# Altium project NFC_EEG.PrjPcb
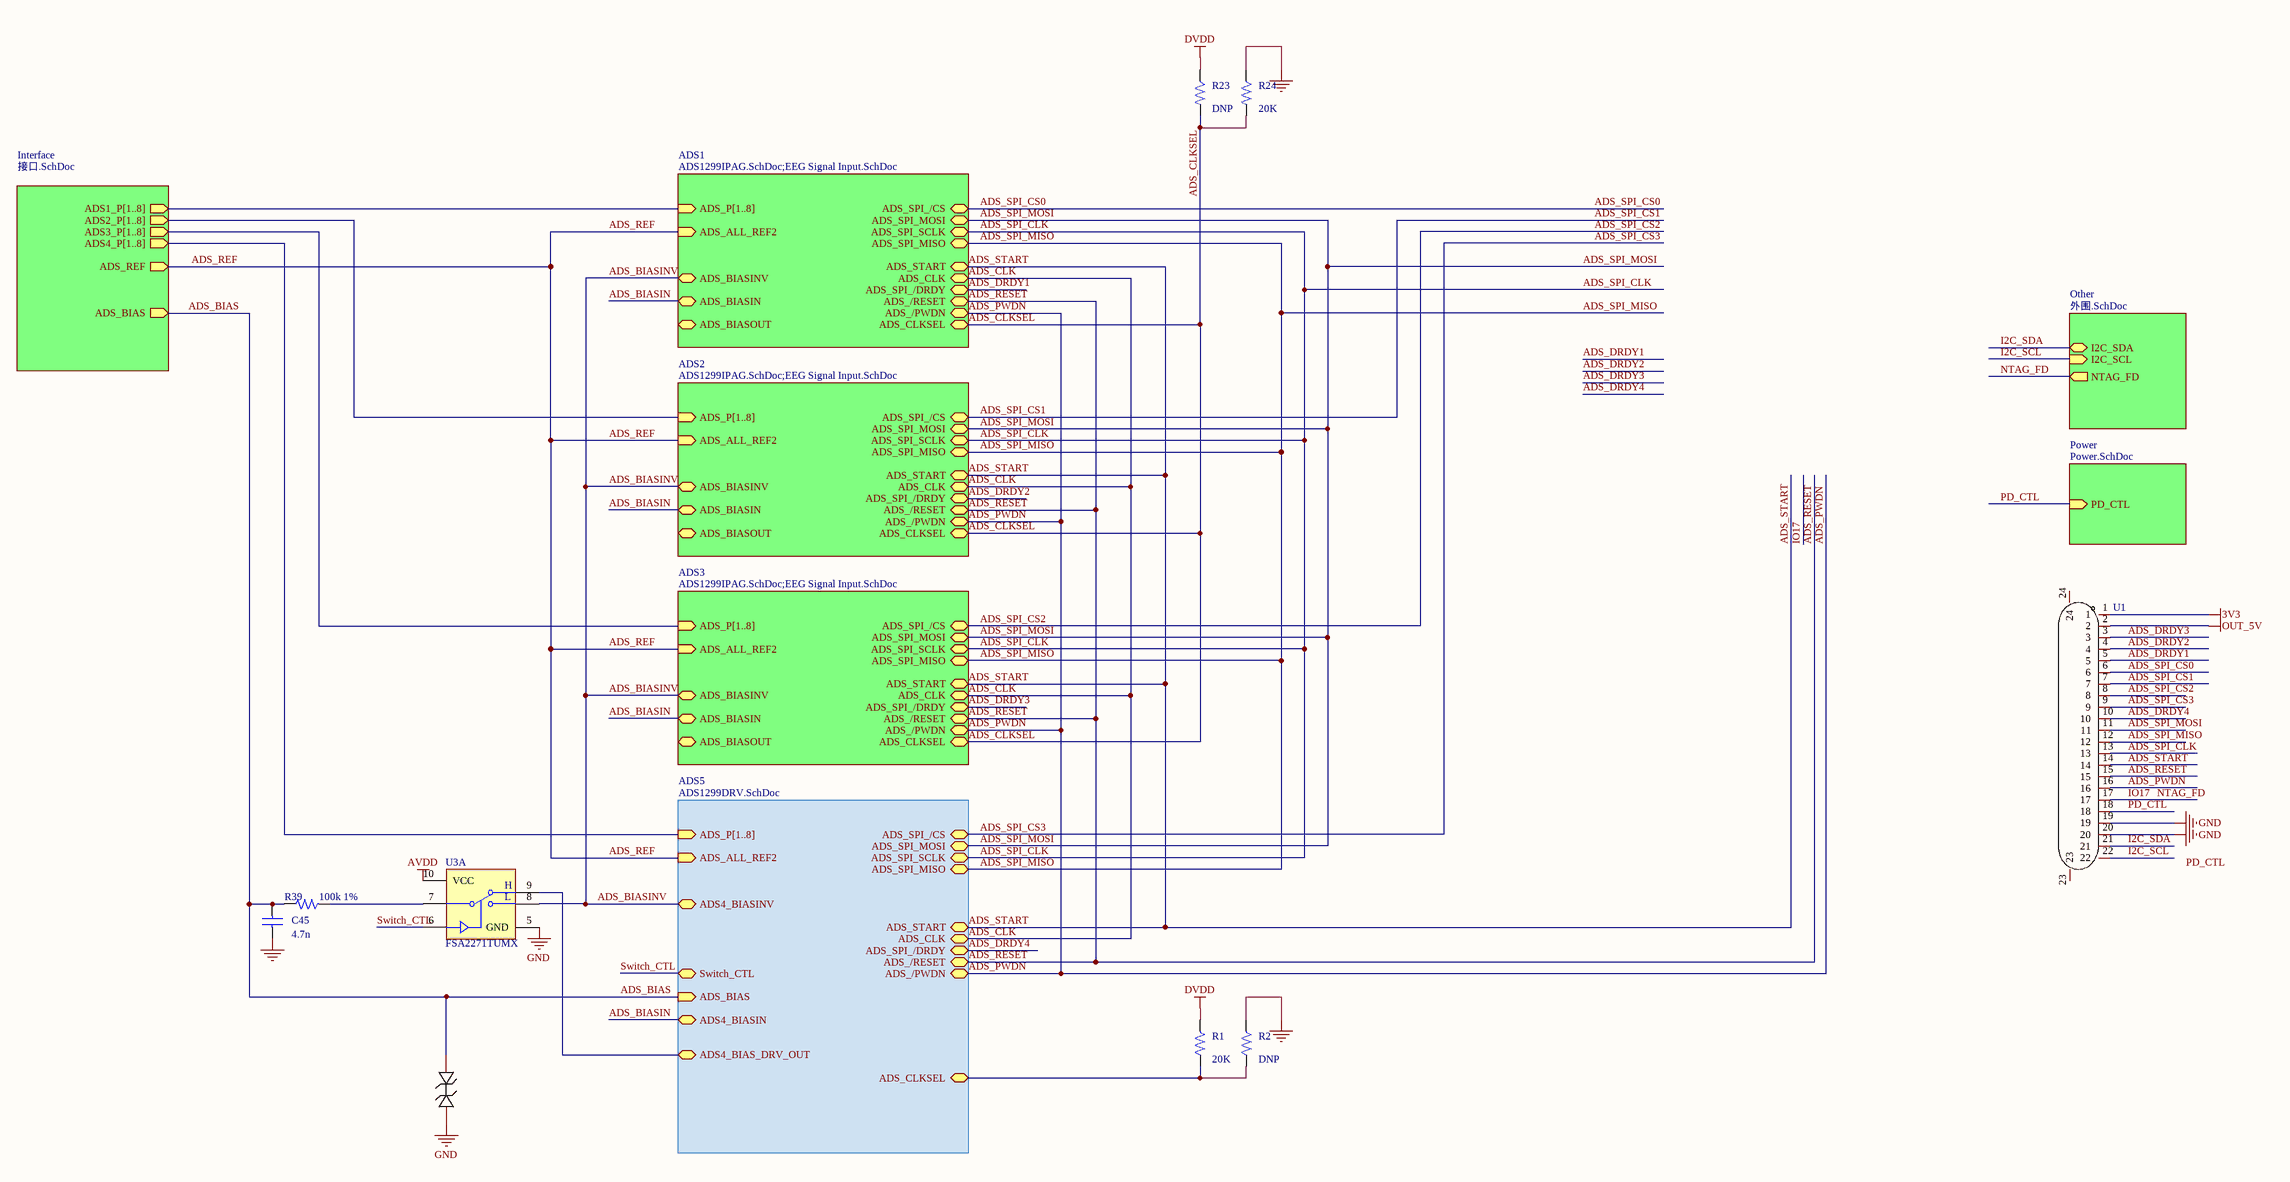
[diagram p0: Main.SchDoc]
7 sheets, 398 parts. Net scope: hierarchical (ports join the sheet entries above them; power ports are global).
Board files: NFC_EEG.PcbDoc, WL-EEG.PcbDoc, ESP32.PcbDoc
Sheets:
  Main.SchDoc
    ADS1 = ADS1299IPAG.SchDoc
    ADS1 = EEG Signal Input.SchDoc
    Interface = 接口.SchDoc
    ADS2 = ADS1299IPAG.SchDoc
    ADS2 = EEG Signal Input.SchDoc
    ADS3 = ADS1299IPAG.SchDoc
    ADS3 = EEG Signal Input.SchDoc
    Other = 外围.SchDoc
    Power = Power.SchDoc
    ADS5 = ADS1299DRV.SchDoc
      ADS4 = ADS1299IPAG.SchDoc
      ADS4 = EEG Signal Input.SchDoc

## Sheet Main.SchDoc
size A2; SheetNumber: 1; SheetTotal: 7

### Parts
C45  4.7n  [0201_C]
D13  D5V0X1B2LP3-7  [X3-DFN0603-2_L0.6-W0.3-BI]  (value not drawn)
R1  20K  [0201_R]
R2  DNP  [0201_R]
R23  DNP  [0201_R]
R24  20K  [0201_R]
R39  100k 1%  [0201_R]
U1  KH-FPC0.5-H1.0SMT-22P-QCHF  [FPC-SMD_22P-P0.50_XKB_X05A10L22G]  (value not drawn)
U3  FSA2271TUMX  [UFQFN-10(1.4x1.8)]  (part A of 2)

### Sub-sheets
ADS1 = ADS1299IPAG.SchDoc;EEG Signal Input.SchDoc: ADS_P[1..8] (in), ADS_SPI_MOSI (bidir), ADS_SPI_/CS (bidir), ADS_SPI_SCLK (bidir), ADS_SPI_MISO (bidir), ADS_ALL_REF2 (in), ADS_BIASINV (bidir), ADS_START (bidir), ADS_CLK (bidir), ADS_SPI_/DRDY (bidir), ADS_/RESET (bidir), ADS_/PWDN (bidir), ADS_BIASIN (bidir), ADS_CLKSEL (bidir), ADS_BIASOUT (bidir)
ADS2 = ADS1299IPAG.SchDoc;EEG Signal Input.SchDoc: ADS_P[1..8] (in), ADS_SPI_MOSI (bidir), ADS_SPI_/CS (bidir), ADS_SPI_SCLK (bidir), ADS_SPI_MISO (bidir), ADS_ALL_REF2 (in), ADS_BIASINV (bidir), ADS_START (bidir), ADS_CLK (bidir), ADS_SPI_/DRDY (bidir), ADS_/RESET (bidir), ADS_/PWDN (bidir), ADS_BIASIN (bidir), ADS_CLKSEL (bidir), ADS_BIASOUT (bidir)
ADS3 = ADS1299IPAG.SchDoc;EEG Signal Input.SchDoc: ADS_P[1..8] (in), ADS_SPI_MOSI (bidir), ADS_SPI_/CS (bidir), ADS_SPI_SCLK (bidir), ADS_SPI_MISO (bidir), ADS_ALL_REF2 (in), ADS_BIASINV (bidir), ADS_START (bidir), ADS_CLK (bidir), ADS_SPI_/DRDY (bidir), ADS_/RESET (bidir), ADS_/PWDN (bidir), ADS_BIASIN (bidir), ADS_CLKSEL (bidir), ADS_BIASOUT (bidir)
ADS5 = ADS1299DRV.SchDoc: ADS_SPI_MOSI (bidir), ADS_SPI_/CS (bidir), ADS_SPI_SCLK (bidir), ADS_SPI_MISO (bidir), ADS_ALL_REF2 (in), ADS4_BIAS_DRV_OUT (bidir), ADS_START (bidir), ADS_CLK (bidir), ADS_SPI_/DRDY (bidir), ADS_/RESET (bidir), ADS_/PWDN (bidir), Switch_CTL (bidir), ADS4_BIASINV (bidir), ADS_BIAS (in), ADS4_BIASIN (bidir), ADS_P[1..8] (in), ADS_CLKSEL (bidir)
Interface = 接口.SchDoc: ADS1_P[1..8] (out), ADS2_P[1..8] (out), ADS3_P[1..8] (out), ADS4_P[1..8] (out), ADS_BIAS (out), ADS_REF (out)
Other = 外围.SchDoc: I2C_SCL (in), I2C_SDA (bidir), NTAG_FD (out)
Power = Power.SchDoc: PD_CTL (in)

### Nets
3V3: R1.1 R23.1 U1.1  [also labelled DVDD]
AVDD: U3.10(VCC)
GND: C45.1 D13.1 R2.1 R24.1 U1.19 U1.20 U3.5(GND)
OUT_5V: U1.2
ADS1_BIAS_DRV: U3.9(1B1) ; sheet ADS5/ADS4_BIAS_DRV_OUT
ADS1_CLKSEL: R1.2 R2.2 ; sheet ADS5/ADS_CLKSEL
ADS_BIAS: C45.2 D13.2 R39.2 ; sheet Interface/ADS_BIAS, sheet ADS5/ADS_BIAS
ADS_BIASIN: U3.8(1B0) ; sheet ADS1/ADS_BIASINV, sheet ADS1/ADS_BIASIN, sheet ADS2/ADS_BIASINV, sheet ADS2/ADS_BIASIN, sheet ADS3/ADS_BIASINV, sheet ADS3/ADS_BIASIN, sheet ADS5/ADS4_BIASINV, sheet ADS5/ADS4_BIASIN  [also labelled ADS_BIASINV]
ADS_CLK: sheet ADS1/ADS_CLK, sheet ADS2/ADS_CLK, sheet ADS3/ADS_CLK, sheet ADS5/ADS_CLK
ADS_CLKSEL: R23.2 R24.2 ; sheet ADS1/ADS_CLKSEL, sheet ADS2/ADS_CLKSEL, sheet ADS3/ADS_CLKSEL
ADS_DRDY1: U1.5 ; sheet ADS1/ADS_SPI_/DRDY
ADS_DRDY2: U1.4 ; sheet ADS2/ADS_SPI_/DRDY
ADS_DRDY3: U1.3 ; sheet ADS3/ADS_SPI_/DRDY
ADS_DRDY4: U1.10 ; sheet ADS5/ADS_SPI_/DRDY
ADS_PWDN: U1.16 ; sheet ADS1/ADS_/PWDN, sheet ADS2/ADS_/PWDN, sheet ADS3/ADS_/PWDN, sheet ADS5/ADS_/PWDN
ADS_REF: sheet ADS1/ADS_ALL_REF2, sheet Interface/ADS_REF, sheet ADS2/ADS_ALL_REF2, sheet ADS3/ADS_ALL_REF2, sheet ADS5/ADS_ALL_REF2
ADS_RESET: U1.15 ; sheet ADS1/ADS_/RESET, sheet ADS2/ADS_/RESET, sheet ADS3/ADS_/RESET, sheet ADS5/ADS_/RESET
ADS_SPI_CLK: U1.13 ; sheet ADS1/ADS_SPI_SCLK, sheet ADS2/ADS_SPI_SCLK, sheet ADS3/ADS_SPI_SCLK, sheet ADS5/ADS_SPI_SCLK
ADS_SPI_CS0: U1.6 ; sheet ADS1/ADS_SPI_/CS
ADS_SPI_CS1: U1.7 ; sheet ADS2/ADS_SPI_/CS
ADS_SPI_CS2: U1.8 ; sheet ADS3/ADS_SPI_/CS
ADS_SPI_CS3: U1.9 ; sheet ADS5/ADS_SPI_/CS
ADS_SPI_MISO: U1.12 ; sheet ADS1/ADS_SPI_MISO, sheet ADS2/ADS_SPI_MISO, sheet ADS3/ADS_SPI_MISO, sheet ADS5/ADS_SPI_MISO
ADS_SPI_MOSI: U1.11 ; sheet ADS1/ADS_SPI_MOSI, sheet ADS2/ADS_SPI_MOSI, sheet ADS3/ADS_SPI_MOSI, sheet ADS5/ADS_SPI_MOSI
ADS_START: U1.14 ; sheet ADS1/ADS_START, sheet ADS2/ADS_START, sheet ADS3/ADS_START, sheet ADS5/ADS_START
I2C_SCL: U1.22 ; sheet Other/I2C_SCL
I2C_SDA: U1.21 ; sheet Other/I2C_SDA
IO17: U1.17 ; sheet Other/NTAG_FD  [also labelled NTAG_FD]
PD_CTL: U1.18 ; sheet Power/PD_CTL
Switch_CTL: U3.6(S1) ; sheet ADS5/Switch_CTL
NetR39_1: R39.1 U3.7(1A)

Not connected (* = marked no-connect by the designer): U1 23 24

### Buses and harness runs
bus sheet ADS1/ADS_P[1..8] = sheet Interface/ADS1_P[1..8]
bus sheet ADS2/ADS_P[1..8] = sheet Interface/ADS2_P[1..8]
bus sheet ADS3/ADS_P[1..8] = sheet Interface/ADS3_P[1..8]
bus sheet ADS5/ADS_P[1..8] = sheet Interface/ADS4_P[1..8]

### Notes on the sheet
- Labels drawn without touching a wire or pin: PD_CTL
- (in symbol FSA2271TUMX, part A) H; L

### Library data of the parts
C45 = CAP0402: CAP CER 4700PF 50V X7R 0402; Part Number: CC0402KRX7R9BB472; Manufacturer: YAGEO; FPLIST: 0402_smd; PCB Footprint: C0603; Distributor: LCSC; Distributor Part Number: C106208; Distributor Link: https://item.szlcsc.com/107423.html; Manufacturer Part Number: CC0402KRX7R9BB472
D13 = D5V0X1B2LP3-7: Manufacturer: DIODES(美台); Add into BOM: yes; Reverse Stand-Off Voltage (Vrwm): 5.5V; Breakdown Voltage (VBR): 7V; Clamping Voltage@Ipp: 14V; Junction Capacitance(Cj)@1MHz: 0.3pF@1MHz; Name: D5V0X1B2LP3-7; Symbol: D5V0X1B2LP3-7; Device: D5V0X1B2LP3-7; LCSC Part Name: D5V0X1B2LP3-7; Supplier Part: C526514; Manufacturer Part: D5V0X1B2LP3-7; Supplier Footprint: X3-DFN0603-2; JLCPCB Part Class: Extended Part; Datasheet: https://atta.szlcsc.com/upload/public/pdf/source/20200528/C526514_1B9BA5DE30498B0D24898FE9BE74AB8A.pdf; Supplier: LCSC; Convert to PCB: yes; Peak Pulse Power(Ppp)@8/20us: -; Operating Temperature: -65℃~+150℃@(Tj)
R1 R24 = RES: RES SMD 0 OHM JUMPER 1/16W 0402; Part Number: RC0402FR-070RL; Manufacturer: YAGEO; PCB Footprint: R0402; Distributor Link: https://item.szlcsc.com/107446.html; Distributor: LCSC; Distributor Part Number: C106231; Manufacturer Part Number: RC0402FR-070RL
R2 R23 = RES: PCB Footprint: R0402
R39 = RES: Part Number: RC0402FR-074K99L; Manufacturer: YAGEO; PCB Footprint: R0402; Distributor Link: https://item.szlcsc.com/149281.html; Distributor: LCSC; Distributor Part Number: C137965; Manufacturer Part Number: RC0402FR-074K99L
U1 = KH-FPC0.5-H1.0SMT-22P-QCHF: 锁定特性:翻盖式;触点数量:22P;间距:0.5mm;; Manufacturer: kinghelm(金航标); Add into BOM: yes; Locking Feature: 翻盖式; Number of Contacts: 22P; Pitch: 0.5mm; Name: KH-FPC0.5-H1.0SMT-22P-QCHF; Symbol: KH-FPC0.5-H1.0SMT-22P-QCHF; Device: KH-FPC0.5-H1.0SMT-22P-QCHF; LCSC Part Name: KH-FPC0.5-H1.0SMT-22P-QCHF; Supplier Part: C3250120; Manufacturer Part: KH-FPC0.5-H1.0SMT-22P-QCHF; Supplier Footprint: SMD,P=0.5mm; JLCPCB Part Class: 扩展库; Datasheet: https://atta.szlcsc.com/upload/public/pdf/source/20220629/AF128159C3D91429B5983CCCE2A07C6D.pdf; Supplier: LCSC; Convert to PCB: yes; Height Above Board: 1mm

## Sheet ADS1299IPAG.SchDoc
size A3; SheetNumber: 4; SheetTotal: 9
Used 4 times, as channels ADS1, ADS2, ADS3, ADS5/ADS4. Parts and nets are listed once, with the designators drawn on the sheet.
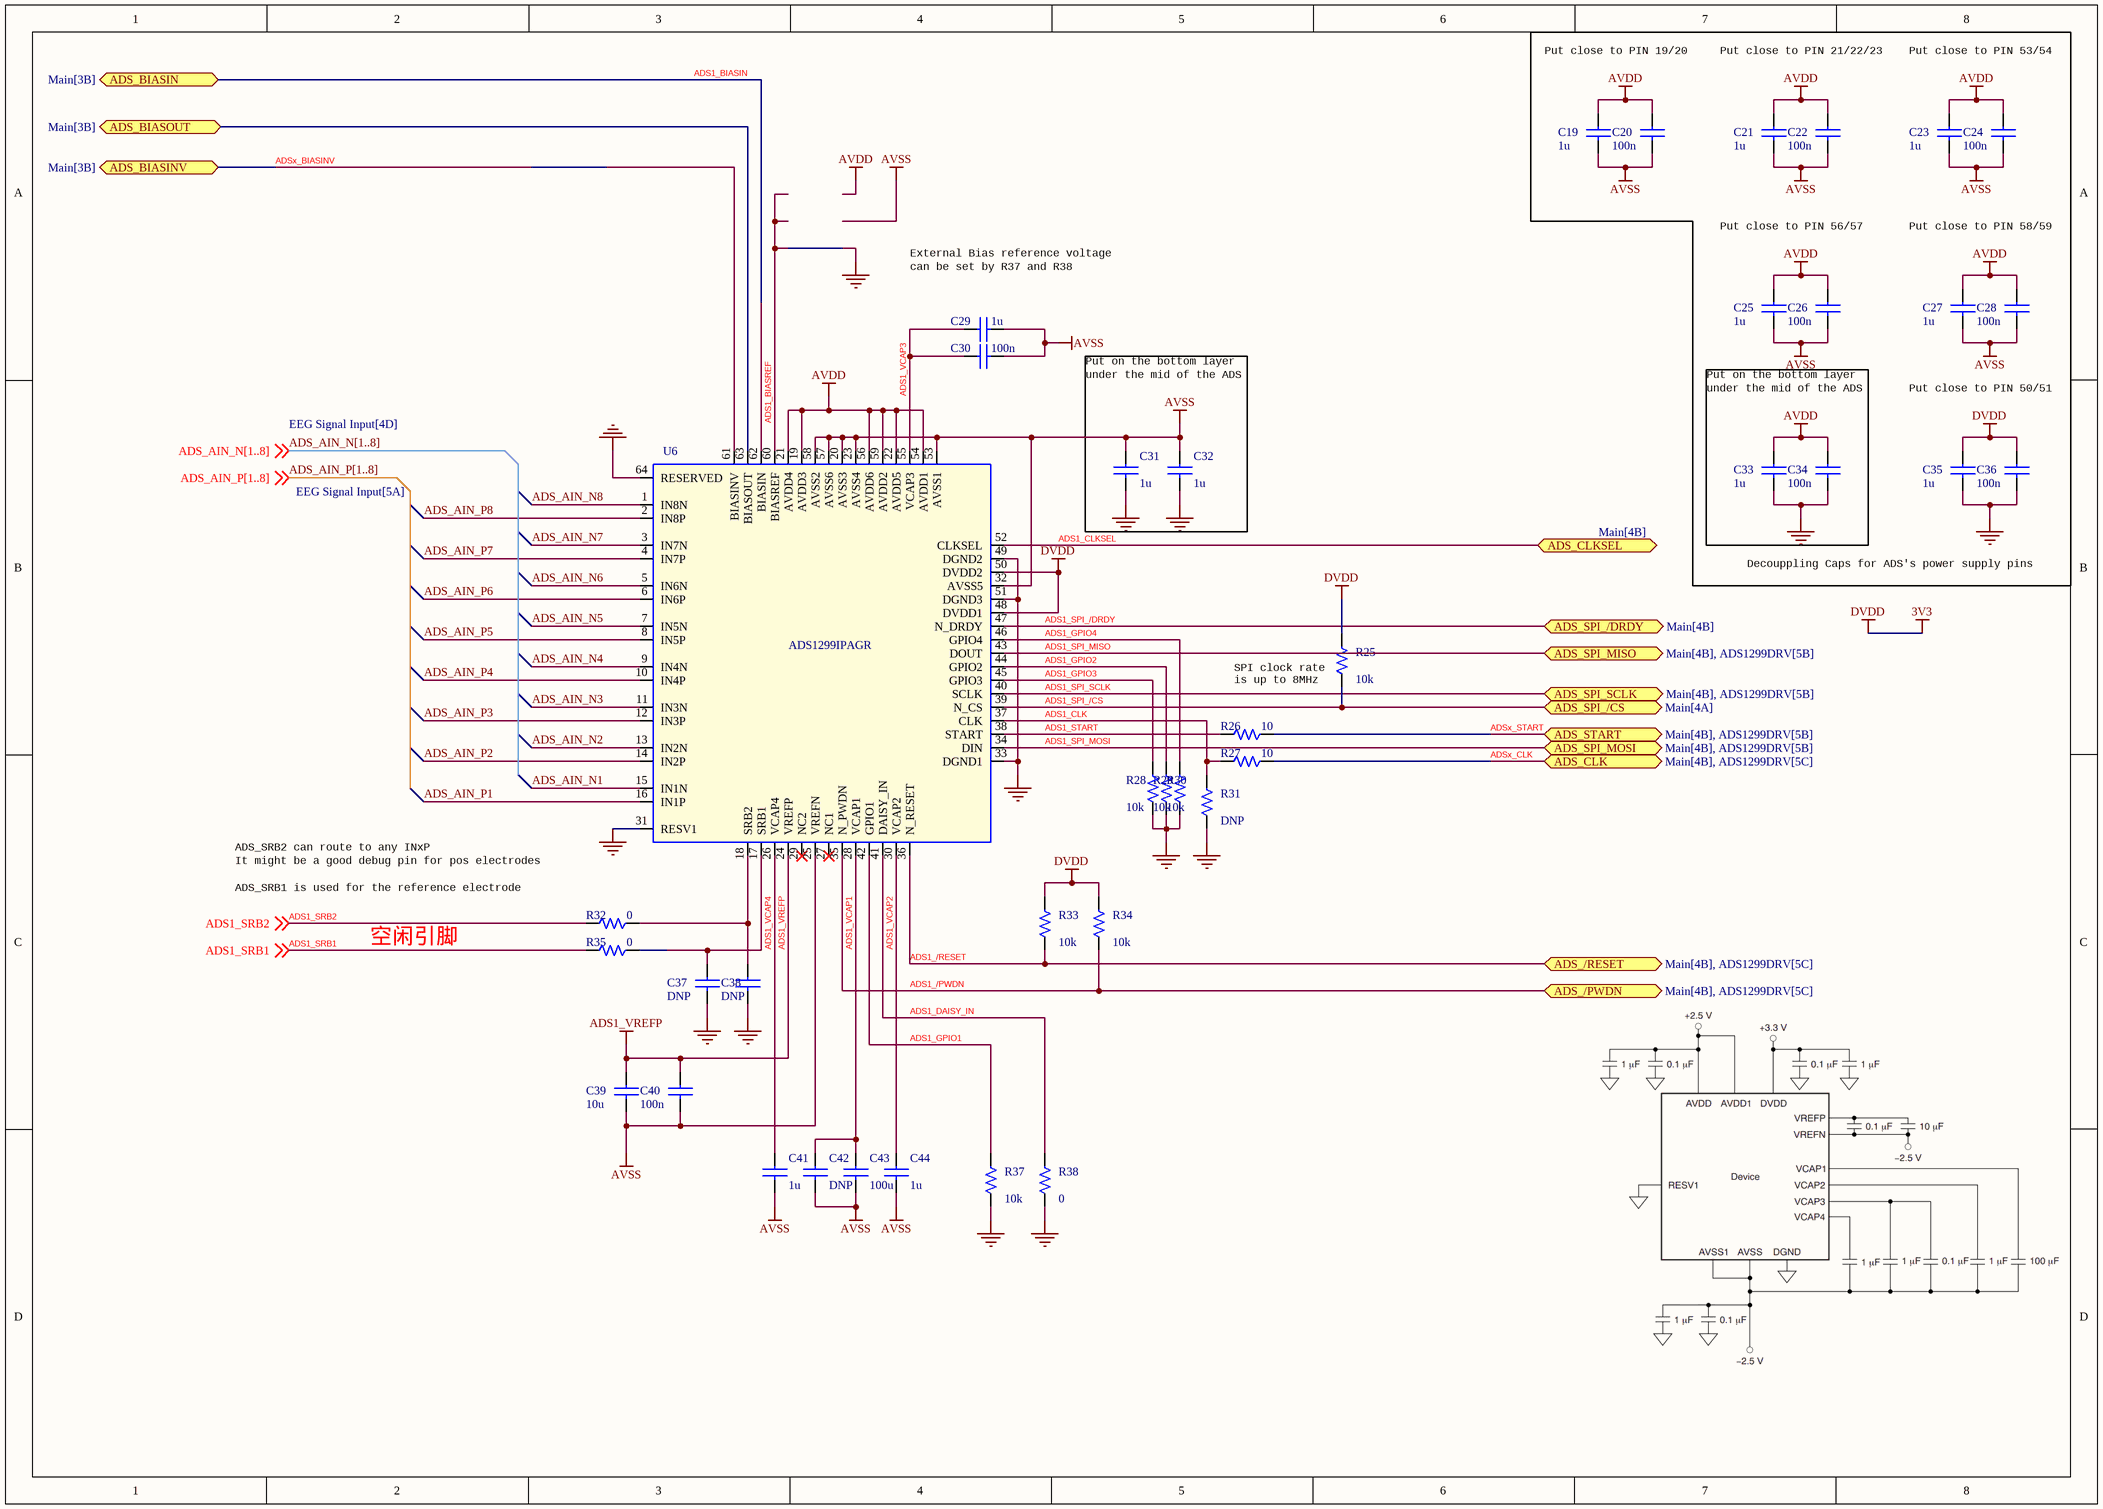
[diagram p1: ADS1299IPAG.SchDoc]

### Parts
C19  1u  [0201_C]
C20  100n  [0201_C]
C21  1u  [0201_C]
C22  100n  [0201_C]
C23  1u  [0201_C]
C24  100n  [0201_C]
C25  1u  [0201_C]
C26  100n  [0201_C]
C27  1u  [0201_C]
C28  100n  [0201_C]
C29  1u  [0201_C]
C30  100n  [0201_C]
C31  1u  [0201_C]
C32  1u  [0201_C]
C33  1u  [0201_C]
C34  100n  [0201_C]
C35  1u  [0201_C]
C36  100n  [0201_C]
C37  DNP  [0402_C]
C38  DNP  [0402_C]
C39  10u  [0402_C]
C40  100n  [0201_C]
C41  1u  [0201_C]
C42  DNP  [0201_C]
C43  100u  [0201_C]
C44  1u  [0201_C]
R25  10k  [0201_R]
R26  10  [0201_R]
R27  10  [0201_R]
R28  10k  [0201_R]
R29  10k  [0201_R]
R30  10k  [0201_R]
R31  DNP  [0201_R]
R32  0  [0402_R]
R33  10k  [0201_R]
R34  10k  [0201_R]
R35  0  [0402_R]
R37  10k  [0201_R]
R38  0  [0201_R]
U6  ADS1299IPAGR  [TQFP-64_L10.0-W10.0-P0.50-LS12.0-TL]

### Ports
ADS_/PWDN (bidir, see Main[4B], ADS1299DRV[5C]), ADS_/RESET (bidir, see Main[4B], ADS1299DRV[5C]), ADS_BIASIN (bidir, see Main[3B]), ADS_BIASINV (bidir, see Main[3B]), ADS_BIASOUT (bidir, see Main[3B]), ADS_CLK (bidir, see Main[4B], ADS1299DRV[5C]), ADS_CLKSEL (bidir, see Main[4B]), ADS_SPI_/CS (bidir, see Main[4A]), ADS_SPI_/DRDY (bidir, see Main[4B]), ADS_SPI_MISO (bidir, see Main[4B], ADS1299DRV[5B]), ADS_SPI_MOSI (bidir, see Main[4B], ADS1299DRV[5B]), ADS_SPI_SCLK (bidir, see Main[4B], ADS1299DRV[5B]), ADS_START (bidir, see Main[4B], ADS1299DRV[5B])

### Nets
3V3: C35.1 C36.1 R25.1 R33.1 R34.1 U6.48(DVDD1) U6.50(DVDD2)  [also labelled DVDD]
ADS1_VREFP: C39.1 C40.1 U6.24(VREFP)
AVDD: C19.1 C20.1 C21.1 C22.1 C23.1 C24.1 C25.1 C26.1 C27.1 C28.1 C33.1 C34.1 U6.19(AVDD3) U6.21(AVDD4) U6.22(AVDD5) U6.54(AVDD1) U6.56(AVDD6) U6.59(AVDD2)
AVSS: C19.2 C20.2 C21.2 C22.2 C23.2 C24.2 C25.2 C26.2 C27.2 C28.2 C29.2 C30.2 C31.1 C32.1 C39.2 C40.2 C41.2 C42.2 C43.2 C44.2 U6.20(AVSS3) U6.23(AVSS4) U6.25(VREFN) U6.32(AVSS5) U6.53(AVSS1) U6.57(AVSS6) U6.58(AVSS2)
GND: C31.2 C32.2 C33.2 C34.2 C35.2 C36.2 C37.2 C38.2 R28.2 R29.2 R30.2 R31.2 R37.2 R38.2 U6.31(RESV1) U6.33(DGND1) U6.49(DGND2) U6.51(DGND3) U6.60(BIASREF) U6.64(RESERVED)  [also labelled ADS1_BIASREF]
ADS1_/PWDN: R34.2 U6.35(N_PWDN) ; port ADS_/PWDN
ADS1_/RESET: R33.2 U6.36(N_RESET) ; port ADS_/RESET
ADS1_BIASIN: U6.62(BIASIN) ; port ADS_BIASIN
ADS1_CLK: R27.2 R31.1 U6.37(CLK)
ADS1_CLKSEL: U6.52(CLKSEL) ; port ADS_CLKSEL
ADS1_DAISY_IN: R38.1 U6.41(DAISY_IN)
ADS1_GPIO1: R37.1 U6.42(GPIO1)
ADS1_GPIO2: R29.1 U6.44(GPIO2)
ADS1_GPIO3: R28.1 U6.45(GPIO3)
ADS1_GPIO4: R30.1 U6.46(GPIO4)
ADS1_SPI_/CS: R25.2 U6.39(N_CS) ; port ADS_SPI_/CS
ADS1_SPI_/DRDY: U6.47(N_DRDY) ; port ADS_SPI_/DRDY
ADS1_SPI_MISO: U6.43(DOUT) ; port ADS_SPI_MISO
ADS1_SPI_MOSI: U6.34(DIN) ; port ADS_SPI_MOSI
ADS1_SPI_SCLK: U6.40(SCLK) ; port ADS_SPI_SCLK
ADS1_SRB1: R35.2 ; off-sheet ADS1_SRB1
ADS1_SRB2: R32.2 ; off-sheet ADS1_SRB2
ADS1_START: R26.2 U6.38(START)
ADS1_VCAP1: C42.1 C43.1 U6.28(VCAP1)
ADS1_VCAP2: C44.1 U6.30(VCAP2)
ADS1_VCAP3: C29.1 C30.1 U6.55(VCAP3)
ADS1_VCAP4: C41.1 U6.26(VCAP4)
ADS_AIN_N1: U6.15(IN1N)
ADS_AIN_N2: U6.13(IN2N)
ADS_AIN_N3: U6.11(IN3N)
ADS_AIN_N4: U6.9(IN4N)
ADS_AIN_N5: U6.7(IN5N)
ADS_AIN_N6: U6.5(IN6N)
ADS_AIN_N7: U6.3(IN7N)
ADS_AIN_N8: U6.1(IN8N)
ADS_AIN_P1: U6.16(IN1P)
ADS_AIN_P2: U6.14(IN2P)
ADS_AIN_P3: U6.12(IN3P)
ADS_AIN_P4: U6.10(IN4P)
ADS_AIN_P5: U6.8(IN5P)
ADS_AIN_P6: U6.6(IN6P)
ADS_AIN_P7: U6.4(IN7P)
ADS_AIN_P8: U6.2(IN8P)
ADS_BIASOUT: U6.63(BIASOUT) ; port ADS_BIASOUT
ADSx_BIASINV: U6.61(BIASINV) ; port ADS_BIASINV
ADSx_CLK: R27.1 ; port ADS_CLK
ADSx_START: R26.1 ; port ADS_START
NetC37_1: C37.1 R35.1 U6.17(SRB1)
NetC38_1: C38.1 R32.1 U6.18(SRB2)

Not connected (* = marked no-connect by the designer): U6 27(NC1)* 29(NC2)*

### Channels
ADS1: designators end in _ADS1; ports ADS_/PWDN=ADS_PWDN ADS_/RESET=ADS_RESET ADS_BIASIN=ADS_BIASIN ADS_BIASINV=ADS_BIASIN ADS_BIASOUT=NetU6_ADS1_63 ADS_CLK=ADS_CLK ADS_CLKSEL=ADS_CLKSEL ADS_SPI_/CS=ADS_SPI_CS0 ADS_SPI_/DRDY=ADS_DRDY1 ADS_SPI_MISO=ADS_SPI_MISO ADS_SPI_MOSI=ADS_SPI_MOSI ADS_SPI_SCLK=ADS_SPI_CLK ADS_START=ADS_START
ADS2: designators end in _ADS2; ports ADS_/PWDN=ADS_PWDN ADS_/RESET=ADS_RESET ADS_BIASIN=ADS_BIASIN ADS_BIASINV=ADS_BIASIN ADS_BIASOUT=NetU6_ADS2_63 ADS_CLK=ADS_CLK ADS_CLKSEL=ADS_CLKSEL ADS_SPI_/CS=ADS_SPI_CS1 ADS_SPI_/DRDY=ADS_DRDY2 ADS_SPI_MISO=ADS_SPI_MISO ADS_SPI_MOSI=ADS_SPI_MOSI ADS_SPI_SCLK=ADS_SPI_CLK ADS_START=ADS_START
ADS3: designators end in _ADS3; ports ADS_/PWDN=ADS_PWDN ADS_/RESET=ADS_RESET ADS_BIASIN=ADS_BIASIN ADS_BIASINV=ADS_BIASIN ADS_BIASOUT=NetU6_ADS3_63 ADS_CLK=ADS_CLK ADS_CLKSEL=ADS_CLKSEL ADS_SPI_/CS=ADS_SPI_CS2 ADS_SPI_/DRDY=ADS_DRDY3 ADS_SPI_MISO=ADS_SPI_MISO ADS_SPI_MOSI=ADS_SPI_MOSI ADS_SPI_SCLK=ADS_SPI_CLK ADS_START=ADS_START
ADS5/ADS4: designators end in _ADS4; ports ADS_/PWDN=ADS_PWDN ADS_/RESET=ADS_RESET ADS_BIASIN=ADS_BIASIN ADS_BIASINV=ADS_BIASIN ADS_BIASOUT=ADS_BIASOUT ADS_CLK=ADS_CLK ADS_CLKSEL=ADS1_CLKSEL ADS_SPI_/CS=ADS_SPI_CS3 ADS_SPI_/DRDY=ADS_DRDY4 ADS_SPI_MISO=ADS_SPI_MISO ADS_SPI_MOSI=ADS_SPI_MOSI ADS_SPI_SCLK=ADS_SPI_CLK ADS_START=ADS_START

### Buses and harness runs
bus ADS_AIN_N[1..8]
bus ADS_AIN_P[1..8]

### Notes on the sheet
- Put close to PIN 19/20
- Put close to PIN 21/22/23
- Put close to PIN 53/54
- Put close to PIN 56/57
- Put close to PIN 58/59
- External Bias reference voltage
- can be set by R37 and R38
- Put on the bottom layer
- under the mid of the ADS
- Put close to PIN 50/51
- Decouppling Caps for ADS's power supply pins
- (near R25) SPI clock rate
  is up to 8MHz
- ADS_SRB2 can route to any INxP
- ADS_SRB1 is used for the reference electrode
- It might be a good debug pin for pos electrodes
- 空闲引脚

### Library data of the parts
C19 C21 C23 C25 C27 C29 C31-C33 C35 C41 C44 = CAP0402: CAP CER 1UF 25V X5R 0402; Part Number: CC0402KRX5R8BB105; Manufacturer: YAGEO; FPLIST: 0402_smd; PCB Footprint: C0402; Distributor: LCSC; Distributor Part Number: C326568; Distributor Link: https://item.szlcsc.com/306662.html; Manufacturer Part Number: CC0402KRX5R8BB105
C20 C22 C24 C26 C28 C30 C34 C36 C40 = CAP0402: CAP CER 0.1UF 25V X7R 0402; Part Number: CC0402KRX7R8BB104; Manufacturer: YAGEO; FPLIST: 0402_smd; PCB Footprint: C0402; Distributor: LCSC; Distributor Part Number: C105883; Distributor Link: https://item.szlcsc.com/107098.html; Manufacturer Part Number: CC0402KRX7R8BB104
C37 C38 C42 = CAP0402: FPLIST: 0402_smd; PCB Footprint: C0402
C39 = CAP0402: CAP CER 10UF 10V X5R 0603; Part Number: CL10A106KP8NNNC; Manufacturer: Samsung Electro-Mechanics; FPLIST: 0402_smd; PCB Footprint: C0603; Distributor: LCSC; Distributor Part Number: C19702; Distributor Link: https://item.szlcsc.com/20411.html; Manufacturer Part Number: CL10A106KP8NNNC
C43 = CAP0402: CAP CER 100UF 10V X5R 1206; Part Number: GRM31CR61A107ME05L; Manufacturer: Murata Electronics; FPLIST: 0402_smd; PCB Footprint: C1206; Distributor: LCSC; Distributor Part Number: C312983; Distributor Link: https://item.szlcsc.com/295691.html; Manufacturer Part Number: GRM31CR61A107ME05L
R25 R28-R30 R37 = RES: RES SMD 10K OHM 1% 1/16W 0402; Manufacturer: YAGEO; Manufacturer Part Number: RC0402FR-0710KL; PCB Footprint: R0402; Part Number: RC0402FR-0710KL; Distributor Part Number: C60490; Distributor: LCSC; Distributor Link: https://item.szlcsc.com/61542.html
R26 R27 = RES: RES SMD 10 OHM 1% 1/10W 0402; Manufacturer: YAGEO; Manufacturer Part Number: RC0402FR-0710RL; PCB Footprint: R0402; Part Number: RC0402FR-0710RL; Distributor Part Number: C138066; Distributor: LCSC; Distributor Link: https://item.szlcsc.com/149382.html
R31 = RES: PCB Footprint: R0402
R32 = RES: as R1 on sheet Main; Distributor Link: https://item.szlcsc.com/107446.html; Distributor: LCSC; Distributor Part Number: C106231; Manufacturer Part Number: RC0402FR-070RL
R33 R34 = RES: RES SMD 10K OHM 1% 1/16W 0402; Part Number: RC0402FR-0710KL; Manufacturer: YAGEO; PCB Footprint: R0402; Distributor Link: https://item.szlcsc.com/61542.html; Distributor: LCSC; Distributor Part Number: C60490; Manufacturer Part Number: RC0402FR-0710KL
R35 R38 = RES: RES SMD 0 OHM JUMPER 1/16W 0402; Manufacturer: YAGEO; Manufacturer Part Number: RC0402FR-070RL; PCB Footprint: R0402; Part Number: RC0402FR-070RL; Distributor Part Number: C106231; Distributor: LCSC; Distributor Link: https://item.szlcsc.com/107446.html
U6 = ADS1299IPAGR: IC AFE 8 CHAN 24BIT 64TQFP; Manufacturer: Texas Instruments; PCB Footprint: ADS1299IPAGR_TQFP64; Distributor Link: https://www.digikey.cn/product-detail/zh/texas-instruments/ADS1299IPAGR/296-34818-1-ND/3536905?keywords=ADS1299IPAGR; Distributor: Digikey; Manufacturer Part Number: ADS1299IPAGR; Part Number: ADS1299IPAGR; Distributor Part Number: 296-34818-1-ND

## Sheet EEG Signal Input.SchDoc
size A2; SheetNumber: 6; SheetTotal: 9
Used 4 times, as channels ADS1, ADS2, ADS3, ADS5/ADS4. Parts and nets are listed once, with the designators drawn on the sheet.
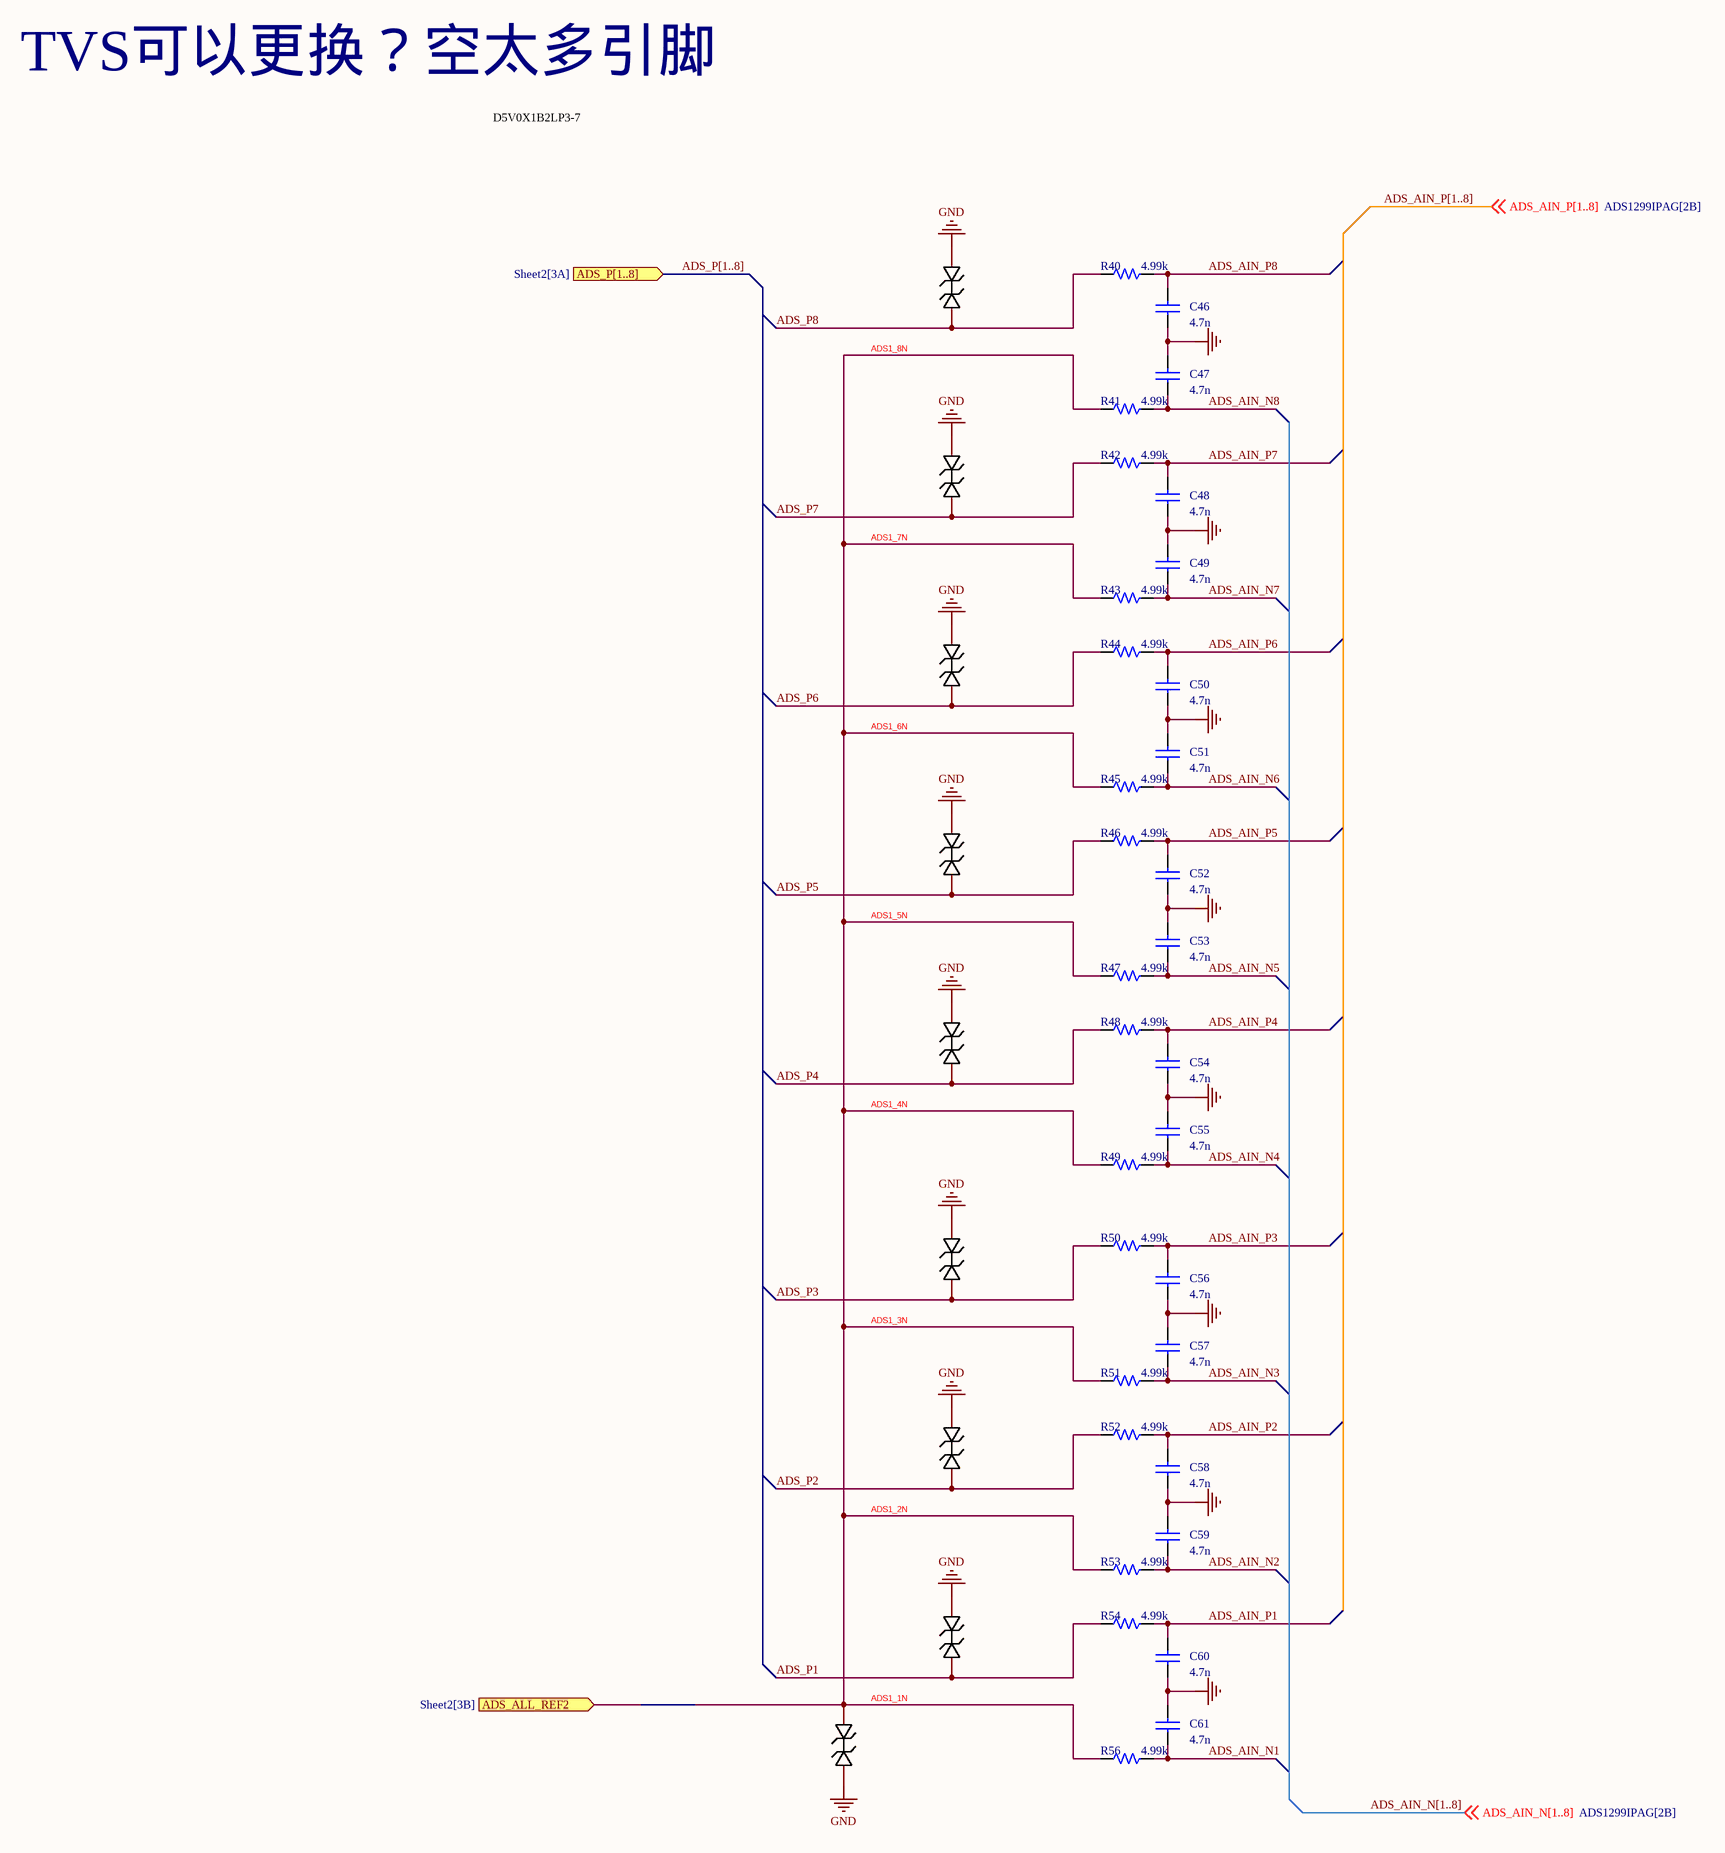
[diagram p2: EEG Signal Input.SchDoc]

### Parts
C46  4.7n  [0201_C]
C47  4.7n  [0201_C]
C48  4.7n  [0201_C]
C49  4.7n  [0201_C]
C50  4.7n  [0201_C]
C51  4.7n  [0201_C]
C52  4.7n  [0201_C]
C53  4.7n  [0201_C]
C54  4.7n  [0201_C]
C55  4.7n  [0201_C]
C56  4.7n  [0201_C]
C57  4.7n  [0201_C]
C58  4.7n  [0201_C]
C59  4.7n  [0201_C]
C60  4.7n  [0201_C]
C61  4.7n  [0201_C]
D4  D5V0X1B2LP3-7  [X3-DFN0603-2_L0.6-W0.3-BI]  (value not drawn)
D5  D5V0X1B2LP3-7  [X3-DFN0603-2_L0.6-W0.3-BI]  (value not drawn)
D6  D5V0X1B2LP3-7  [X3-DFN0603-2_L0.6-W0.3-BI]  (value not drawn)
D7  D5V0X1B2LP3-7  [X3-DFN0603-2_L0.6-W0.3-BI]  (value not drawn)
D8  D5V0X1B2LP3-7  [X3-DFN0603-2_L0.6-W0.3-BI]  (value not drawn)
D9  D5V0X1B2LP3-7  [X3-DFN0603-2_L0.6-W0.3-BI]  (value not drawn)
D10  D5V0X1B2LP3-7  [X3-DFN0603-2_L0.6-W0.3-BI]  (value not drawn)
D11  D5V0X1B2LP3-7  [X3-DFN0603-2_L0.6-W0.3-BI]  (value not drawn)
D12  D5V0X1B2LP3-7  [X3-DFN0603-2_L0.6-W0.3-BI]  (value not drawn)
R40  4.99k  [0201_R]
R41  4.99k  [0201_R]
R42  4.99k  [0201_R]
R43  4.99k  [0201_R]
R44  4.99k  [0201_R]
R45  4.99k  [0201_R]
R46  4.99k  [0201_R]
R47  4.99k  [0201_R]
R48  4.99k  [0201_R]
R49  4.99k  [0201_R]
R50  4.99k  [0201_R]
R51  4.99k  [0201_R]
R52  4.99k  [0201_R]
R53  4.99k  [0201_R]
R54  4.99k  [0201_R]
R56  4.99k  [0201_R]

### Ports
ADS_ALL_REF2 (in, see Sheet2[3B]), ADS_P[1..8] (in, see Sheet2[3A])

### Nets
GND: C46.1 C47.2 C48.1 C49.2 C50.1 C51.2 C52.1 C53.2 C54.1 C55.2 C56.1 C57.2 C58.1 C59.2 C60.1 C61.2 D4.2 D5.2 D6.2 D7.2 D8.2 D9.2 D10.2 D11.2 D12.2
ADS1_1N: D12.1 R41.2 R43.2 R45.2 R47.2 R49.2 R51.2 R53.2 R56.2 ; port ADS_ALL_REF2  [also labelled ADS1_2N, ADS1_3N, ADS1_4N, ADS1_5N, ADS1_6N, ADS1_7N, ADS1_8N]
ADS_AIN_N1: C61.1 R56.1
ADS_AIN_N2: C59.1 R53.1
ADS_AIN_N3: C57.1 R51.1
ADS_AIN_N4: C55.1 R49.1
ADS_AIN_N5: C53.1 R47.1
ADS_AIN_N6: C51.1 R45.1
ADS_AIN_N7: C49.1 R43.1
ADS_AIN_N8: C47.1 R41.1
ADS_AIN_P1: C60.2 R54.1
ADS_AIN_P2: C58.2 R52.1
ADS_AIN_P3: C56.2 R50.1
ADS_AIN_P4: C54.2 R48.1
ADS_AIN_P5: C52.2 R46.1
ADS_AIN_P6: C50.2 R44.1
ADS_AIN_P7: C48.2 R42.1
ADS_AIN_P8: C46.2 R40.1
ADS_P1: D11.1 R54.2
ADS_P2: D10.1 R52.2
ADS_P3: D9.1 R50.2
ADS_P4: D8.1 R48.2
ADS_P5: D7.1 R46.2
ADS_P6: D6.1 R44.2
ADS_P7: D5.1 R42.2
ADS_P8: D4.1 R40.2

### Channels
ADS1: designators end in _ADS1; ports ADS_ALL_REF2=ADS_REF
ADS2: designators end in _ADS2; ports ADS_ALL_REF2=ADS_REF
ADS3: designators end in _ADS3; ports ADS_ALL_REF2=ADS_REF
ADS5/ADS4: designators end in _ADS4; ports ADS_ALL_REF2=ADS_REF

### Buses and harness runs
bus ADS_AIN_N[1..8]
bus ADS_AIN_P[1..8]
bus ADS_P[1..8] = port ADS_P[1..8]

### Notes on the sheet
- TVS可以更换？空太多引脚
- D5V0X1B2LP3-7

### Library data of the parts
C46-C61 = CAP0402: as C45 on sheet Main; Distributor: LCSC; Distributor Part Number: C106208; Distributor Link: https://item.szlcsc.com/107423.html; Manufacturer Part Number: CC0402KRX7R9BB472
D4-D12 = D5V0X1B2LP3-7: as D13 on sheet Main; Name: D5V0X1B2LP3-7; Symbol: D5V0X1B2LP3-7; Device: D5V0X1B2LP3-7; LCSC Part Name: D5V0X1B2LP3-7; Supplier Part: C526514; Manufacturer Part: D5V0X1B2LP3-7; Supplier Footprint: X3-DFN0603-2; JLCPCB Part Class: Extended Part; Datasheet: https://atta.szlcsc.com/upload/public/pdf/source/20200528/C526514_1B9BA5DE30498B0D24898FE9BE74AB8A.pdf; Supplier: LCSC; Convert to PCB: yes; Peak Pulse Power(Ppp)@8/20us: -; Operating Temperature: -65℃~+150℃@(Tj)
R40 R41 R44 R45 R52 R53 = RES: RES SMD 4.99K OHM 1% 1/16W 0402; Manufacturer: YAGEO; Manufacturer Part Number: RC0402FR-074K99L; PCB Footprint: R0402; Part Number: RC0402FR-074K99L; Distributor Part Number: C137965; Distributor: LCSC; Distributor Link: https://item.szlcsc.com/149281.html
R42 R43 R46-R51 R54 R56 = RES: RES SMD 4.99K OHM 1% 1/16W 0402; Part Number: RC0402FR-074K99L; Manufacturer: YAGEO; PCB Footprint: R0402; Distributor Link: https://item.szlcsc.com/149281.html; Distributor: LCSC; Distributor Part Number: C137965; Manufacturer Part Number: RC0402FR-074K99L

## Sheet 接口.SchDoc
size A4; SheetNumber: 6; SheetTotal: 7
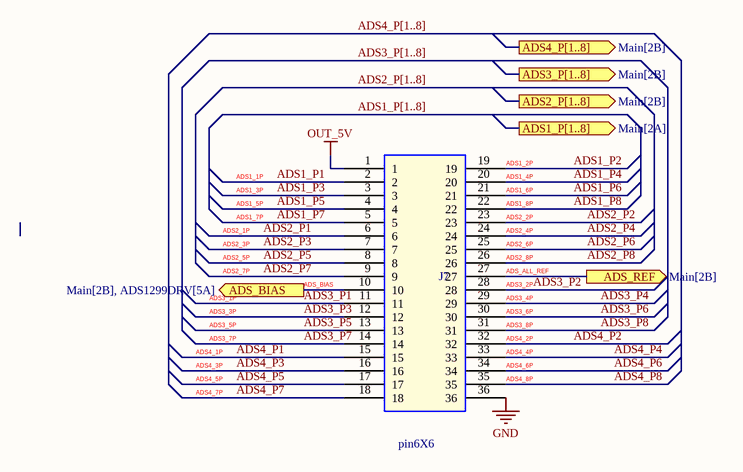
[diagram p3: 接口.SchDoc]

### Parts
J7  pin6X6  [SMD6X6]

### Ports
ADS1_P[1..8] (out, see Main[2A]), ADS2_P[1..8] (out, see Main[2B]), ADS3_P[1..8] (out, see Main[2B]), ADS4_P[1..8] (out, see Main[2B]), ADS_BIAS (out, see Main[2B], ADS1299DRV[5A]), ADS_REF (out, see Main[2B])

### Nets
GND: J7.36
OUT_5V: J7.1
ADS1_1P: J7.2  [also labelled ADS1_P1]
ADS1_2P: J7.19  [also labelled ADS1_P2]
ADS1_3P: J7.3  [also labelled ADS1_P3]
ADS1_4P: J7.20  [also labelled ADS1_P4]
ADS1_5P: J7.4  [also labelled ADS1_P5]
ADS1_6P: J7.21  [also labelled ADS1_P6]
ADS1_7P: J7.5  [also labelled ADS1_P7]
ADS1_8P: J7.22  [also labelled ADS1_P8]
ADS2_1P: J7.6  [also labelled ADS2_P1]
ADS2_2P: J7.23  [also labelled ADS2_P2]
ADS2_3P: J7.7  [also labelled ADS2_P3]
ADS2_4P: J7.24  [also labelled ADS2_P4]
ADS2_5P: J7.8  [also labelled ADS2_P5]
ADS2_6P: J7.25  [also labelled ADS2_P6]
ADS2_7P: J7.9  [also labelled ADS2_P7]
ADS2_8P: J7.26  [also labelled ADS2_P8]
ADS3_1P: J7.11  [also labelled ADS3_P1]
ADS3_2P: J7.28  [also labelled ADS3_P2]
ADS3_3P: J7.12  [also labelled ADS3_P3]
ADS3_4P: J7.29  [also labelled ADS3_P4]
ADS3_5P: J7.13  [also labelled ADS3_P5]
ADS3_6P: J7.30  [also labelled ADS3_P6]
ADS3_7P: J7.14  [also labelled ADS3_P7]
ADS3_8P: J7.31  [also labelled ADS3_P8]
ADS4_1P: J7.15  [also labelled ADS4_P1]
ADS4_2P: J7.32  [also labelled ADS4_P2]
ADS4_3P: J7.16  [also labelled ADS4_P3]
ADS4_4P: J7.33  [also labelled ADS4_P4]
ADS4_5P: J7.17  [also labelled ADS4_P5]
ADS4_6P: J7.34  [also labelled ADS4_P6]
ADS4_7P: J7.18  [also labelled ADS4_P7]
ADS4_8P: J7.35  [also labelled ADS4_P8]
ADS_ALL_REF: J7.27 ; port ADS_REF  [project net ADS_REF]
ADS_BIAS: J7.10 ; port ADS_BIAS

### Buses and harness runs
bus ADS1_P[1..8] = port ADS1_P[1..8]
bus ADS2_P[1..8] = port ADS2_P[1..8]
bus ADS3_P[1..8] = port ADS3_P[1..8]
bus ADS4_P[1..8] = port ADS4_P[1..8]

### Library data of the parts
J7 = PIN6X6: PCB Footprint: pin6X6

## Sheet 外围.SchDoc
size A4; SheetNumber: 3; SheetTotal: 7
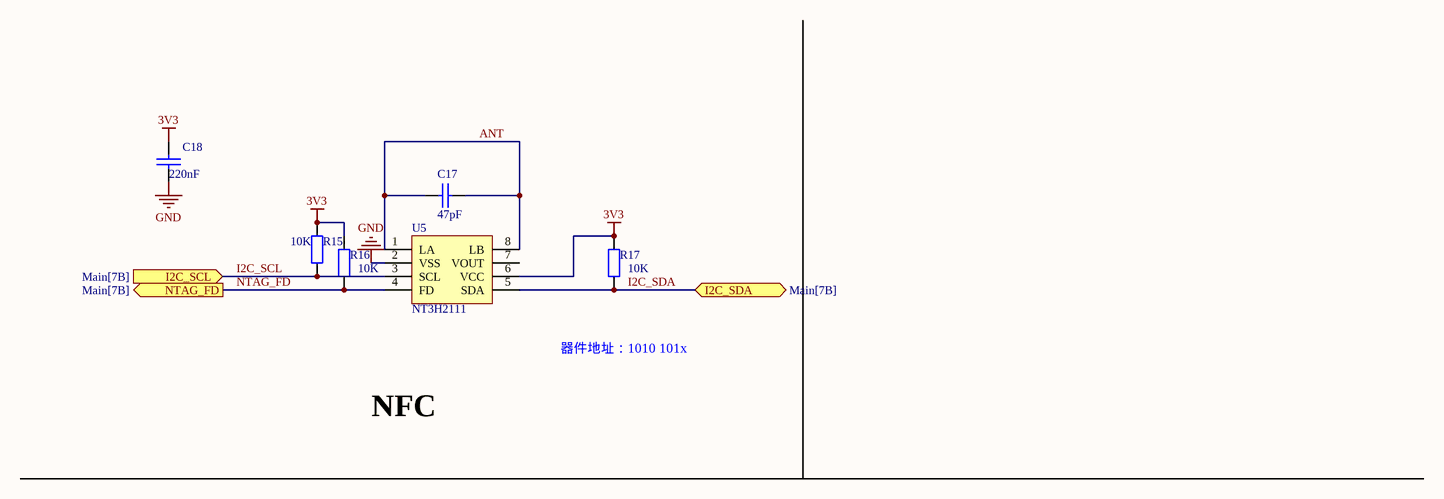
[diagram p4: 外围.SchDoc]

### Parts
C17  47pF  [0402_C]
C18  220nF  [0201_C]
R15  value 10K  [0201_R]  (hidden comment: Res)
R16  value 10K  [0201_R]  (hidden comment: Res)
R17  value 10K  [0201_R]  (hidden comment: Res)
U5  NT3H2111  [TSSOP-8]

### Ports
I2C_SCL (in, see Main[7B]), I2C_SDA (bidir, see Main[7B]), NTAG_FD (out, see Main[7B])

### Nets
3V3: C18.1 R15.1 R16.1 R17.1 U5.6(VCC)
GND: C18.2 U5.2(VSS)
ANT: C17.1 C17.2 U5.1(LA) U5.8(LB)
I2C_SCL: R15.2 U5.3(SCL) ; port I2C_SCL
I2C_SDA: R17.2 U5.5(SDA) ; port I2C_SDA
NTAG_FD: R16.2 U5.4(FD) ; port NTAG_FD  [project net IO17]

Not connected (* = marked no-connect by the designer): U5 7(VOUT)

### Notes on the sheet
- 器件地址：1010 101x
- NFC

### Library data of the parts
C17 C18 = CAP: Capacitor
  C17: Value: 47pF
  C18: Value: 220nF
R15-R17 = Res2: Resistor
U5 = NT3H1101

## Sheet Power.SchDoc
size A2; SheetNumber: 2; SheetTotal: 7
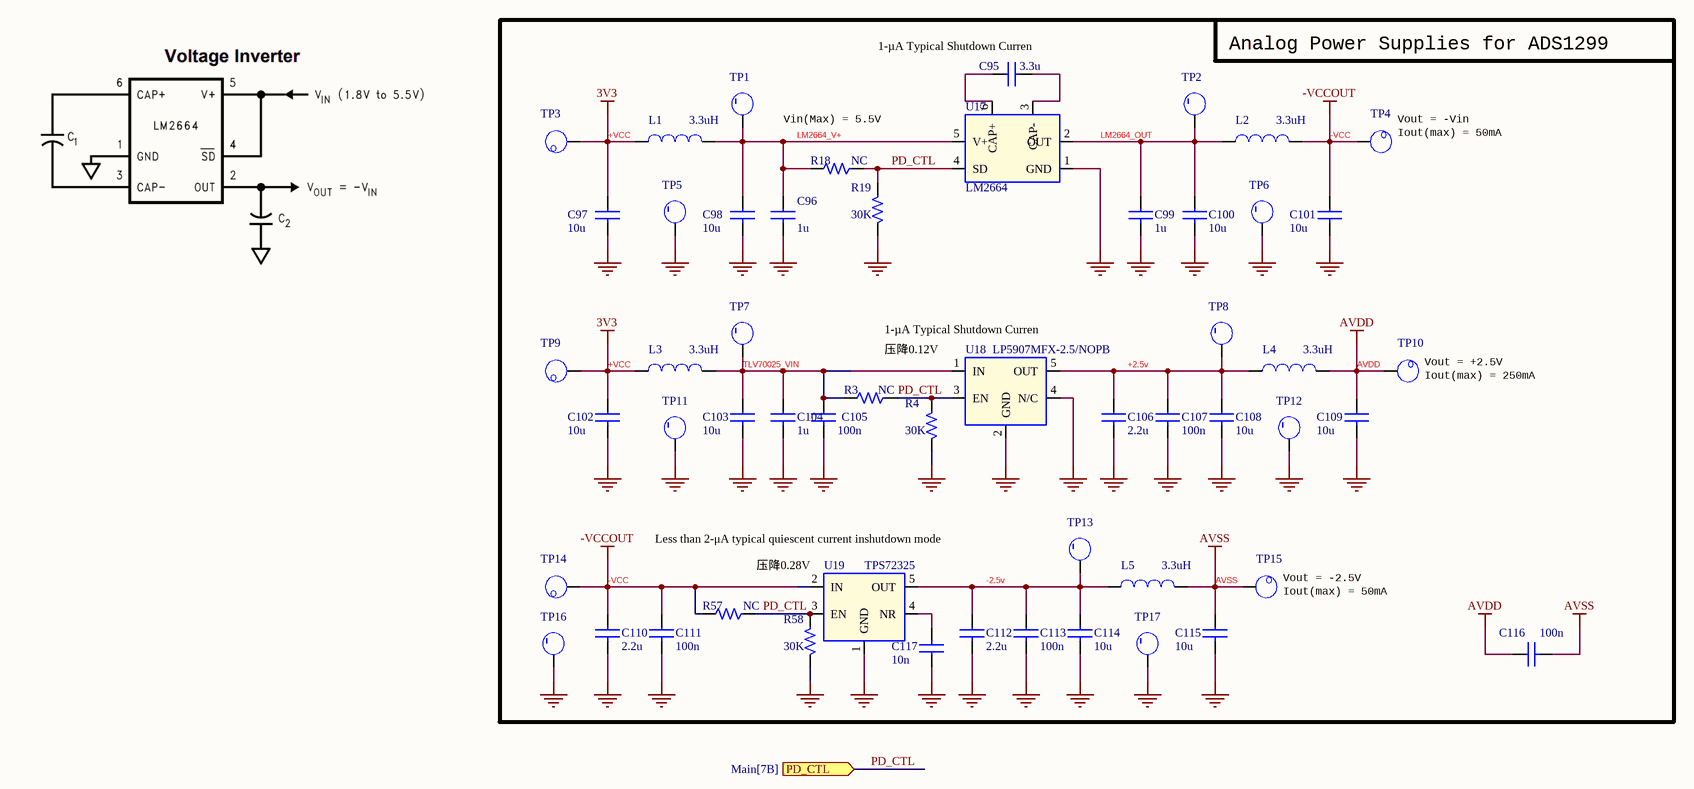
[diagram p5: Power.SchDoc]

### Parts
C95  3.3u  [0402_C]
C96  1u  [0402_C]
C97  10u  [0402_C]
C98  10u  [0402_C]
C99  1u  [0402_C]
C100  10u  [0402_C]
C101  10u  [0402_C]
C102  10u  [0402_C]
C103  10u  [0402_C]
C104  1u  [0402_C]
C105  100n  [0402_C]
C106  2.2u  [0402_C]
C107  100n  [0402_C]
C108  10u  [0402_C]
C109  10u  [0402_C]
C110  2.2u  [0402_C]
C111  100n  [0402_C]
C112  2.2u  [0402_C]
C113  100n  [0402_C]
C114  10u  [0402_C]
C115  10u  [0402_C]
C116  100n  [0201_C]
C117  10n  [0402_C]
L1  3.3uH  [0805_L]
L2  3.3uH  [0805_L]
L3  3.3uH  [0805_L]
L4  3.3uH  [0805_L]
L5  3.3uH  [0805_L]
R3  NC  [0402_R]
R4  30K  [0402_R]
R18  NC  [0402_R]
R19  30K  [0402_R]
R57  NC  [0402_R]
R58  30K  [0402_R]
TP1  SMD_TP_C35  [TEST_Point]  (value not drawn)
TP2  SMD_TP_C35  [TEST_Point]  (value not drawn)
TP3  SMD_TP_C35  [TEST_Point]  (value not drawn)
TP4  SMD_TP_C35  [TEST_Point]  (value not drawn)
TP5  SMD_TP_C35  [TEST_Point]  (value not drawn)
TP6  SMD_TP_C35  [TEST_Point]  (value not drawn)
TP7  SMD_TP_C35  [TEST_Point]  (value not drawn)
TP8  SMD_TP_C35  [TEST_Point]  (value not drawn)
TP9  SMD_TP_C35  [TEST_Point]  (value not drawn)
TP10  SMD_TP_C35  [TEST_Point]  (value not drawn)
TP11  SMD_TP_C35  [TEST_Point]  (value not drawn)
TP12  SMD_TP_C35  [TEST_Point]  (value not drawn)
TP13  SMD_TP_C35  [TEST_Point]  (value not drawn)
TP14  SMD_TP_C35  [TEST_Point]  (value not drawn)
TP15  SMD_TP_C35  [TEST_Point]  (value not drawn)
TP16  SMD_TP_C35  [TEST_Point]  (value not drawn)
TP17  SMD_TP_C35  [TEST_Point]  (value not drawn)
U17  LM2664  [SOT-23-6]
U18  LP5907MFX-2.5/NOPB  [SOT-23_5]
U19  TPS72325  [SOT-23_5]

### Ports
PD_CTL (in, see Main[7B])

### Nets
3V3: C97.1 C102.1 L1.1 L3.1 TP3.1 TP9.1  [also labelled +VCC]
-VCCOUT: C101.1 C110.1 C111.1 L2.2 R57.2 TP4.1 TP14.1 U19.2(IN)  [also labelled -VCC]
AVDD: C109.1 C116.1 L4.2 TP10.1
AVSS: C115.1 C116.2 L5.2 TP15.1
GND: C96.2 C97.2 C98.2 C99.2 C100.2 C101.2 C102.2 C103.2 C104.2 C105.2 C106.2 C107.2 C108.2 C109.2 C110.2 C111.2 C112.2 C113.2 C114.2 C115.2 C117.1 R4.2 R19.2 R58.2 TP5.1 TP6.1 TP11.1 TP12.1 TP16.1 TP17.1 U17.1(GND) U18.2(GND) U18.4(N/C) U19.1(GND)
+2.5v: C106.1 C107.1 C108.1 L4.1 TP8.1 U18.5(OUT)
-2.5v: C112.1 C113.1 C114.1 L5.1 TP13.1 U19.5(OUT)
LM2664_OUT: C99.1 C100.1 L2.1 TP2.1 U17.2(OUT)
LM2664_V+: C96.1 C98.1 L1.2 R18.2 TP1.1 U17.5(V+)
PD_CTL: R3.1 R4.1 R18.1 R19.1 R57.1 R58.1 U17.4(SD) U18.3(EN) U19.3(EN) ; port PD_CTL
TLV70025_VIN: C103.1 C104.1 C105.1 L3.2 R3.2 TP7.1 U18.1(IN)
NetC95_1: C95.1 U17.6(CAP+)
NetC95_2: C95.2 U17.3(CAP-)
NetC117_2: C117.2 U19.4(NR)

### Notes on the sheet
- (near C95) 1-µA Typical Shutdown Curren
- Analog Power Supplies for ADS1299
- Vin(Max) = 5.5V
- (near TP4) Vout = -Vin
- (near TP4) Iout(max) = 50mA
- (near U18) 1-µA Typical Shutdown Curren
- 压降0.12V
- (near TP10) Iout(max) = 250mA
- (near TP10) Vout = +2.5V
- (near U19) Less than 2-μA typical quiescent current inshutdown mode
- 压降0.28V
- (near TP15) Vout = -2.5V
- (near TP15) Iout(max) = 50mA

### Library data of the parts
C95 = CAP0402: CAP CER 3.3UF 10V X5R 0805; Part Number: GRM21BR61A335KA73L; Manufacturer: Murata Electronics; FPLIST: 0402_smd; PCB Footprint: C0805; Distributor: LCSC; Distributor Part Number: C162416; Distributor Link: https://item.szlcsc.com/173797.html; Manufacturer Part Number: GRM21BR61A335KA73L
C96 C99 C104 = CAP0402: CAP CER 1UF 25V X5R 0603; Part Number: GRM188R61E105KA12D; Manufacturer: Murata Electronics; FPLIST: 0402_smd; PCB Footprint: C0603; Distributor: LCSC; Distributor Part Number: C77046; Distributor Link: https://item.szlcsc.com/78173.html; Manufacturer Part Number: GRM188R61E105KA12D
C97 C98 C100-C103 C108 C109 C114 C115 = CAP0402: as C39 on sheet ADS1299IPAG; Distributor: LCSC; Distributor Part Number: C19702; Distributor Link: https://item.szlcsc.com/20411.html; Manufacturer Part Number: CL10A106KP8NNNC
C105 C107 C111 C113 C116 = CAP0402: as C20 on sheet ADS1299IPAG; Distributor: LCSC; Distributor Part Number: C105883; Distributor Link: https://item.szlcsc.com/107098.html; Manufacturer Part Number: CC0402KRX7R8BB104
C106 C110 C112 = CAP0402: CAP CER 2.2UF 25V X5R 0603; Part Number: CC0603KRX5R8BB225; Manufacturer: YAGEO; FPLIST: 0402_smd; PCB Footprint: C0603; Distributor: LCSC; Distributor Part Number: C541409; Distributor Link: https://item.szlcsc.com/293094.html; Manufacturer Part Number: CC0603KRX5R8BB225
C117 = CAP0402: CAP CER 10000PF 25V X7R 0402; Part Number: CC0402KRX7R8BB103; Manufacturer: YAGEO; FPLIST: 0402_smd; PCB Footprint: C0402; Distributor: LCSC; Distributor Part Number: C327025; Distributor Link: https://item.szlcsc.com/307119.html; Manufacturer Part Number: CC0402KRX7R8BB103
L1 L5 = INDUCTOR: FIXED IND 3.3UH 500MA 260 MOHM; Part Number: KLZ2012MHR3R3HTD25; Manufacturer: TDK Corporation; PCB Footprint: L0805; Distributor Link: https://item.szlcsc.com/391913.html; Distributor: LCSC; Manufacturer Part Number: KLZ2012MHR3R3HTD25; Distributor Part Number: C404386
L2-L4 = INDUCTOR: FIXED IND 3.3UH 500MA 260 MOHM; Manufacturer: TDK Corporation; Manufacturer Part Number: KLZ2012MHR3R3HTD25; PCB Footprint: L0805; Distributor Part Number: C404386; Distributor: LCSC; Part Number: KLZ2012MHR3R3HTD25; Distributor Link: https://item.szlcsc.com/391913.html
R3 R18 R57 = RES: as R1 on sheet Main; Distributor Link: https://item.szlcsc.com/107446.html; Distributor: LCSC; Distributor Part Number: C106231; Manufacturer Part Number: RC0402FR-070RL
R4 R19 R58 = RES: PCB Footprint: R0402
TP1-TP17 = CON1_0: PCB Footprint: SMD_TP_C35; Part Type: TP
U17 = LM2664: IC REG CHARG PUMP INV 40MA SOT23; Manufacturer Part Number: LM2664M6X/NOPB; Manufacturer: Texas Instruments; PCB Footprint: SOT_23_6_DBV; Distributor Part Number: C108573; Distributor: LCSC; Part Number: LM2664M6X/NOPB; Distributor Link: https://item.szlcsc.com/109792.html
U18 = LP5907: IC REG LINEAR 2.5V 250MA SOT23-5; Manufacturer: Texas Instruments; PCB Footprint: SOT_23_5_DBV; Distributor Link: https://item.szlcsc.com/176514.html; Manufacturer Part Number: LP5907MFX-2.5/NOPB; Distributor: LCSC; Part Number: LP5907MFX-2.5/NOPB; Distributor Part Number: C165132
U19 = TPS72325: IC REG LIN -2.5V 200MA SOT23-5; Manufacturer Part Number: TPS72325DBVR; Manufacturer: Texas Instruments; PCB Footprint: SOT_23_5_DBV; Distributor Link: https://item.szlcsc.com/71027.html; Distributor: LCSC; Part Number: TPS72325DBVR; Distributor Part Number: C69932

## Sheet ADS1299DRV.SchDoc
size A2; SheetNumber: 7; SheetTotal: 7
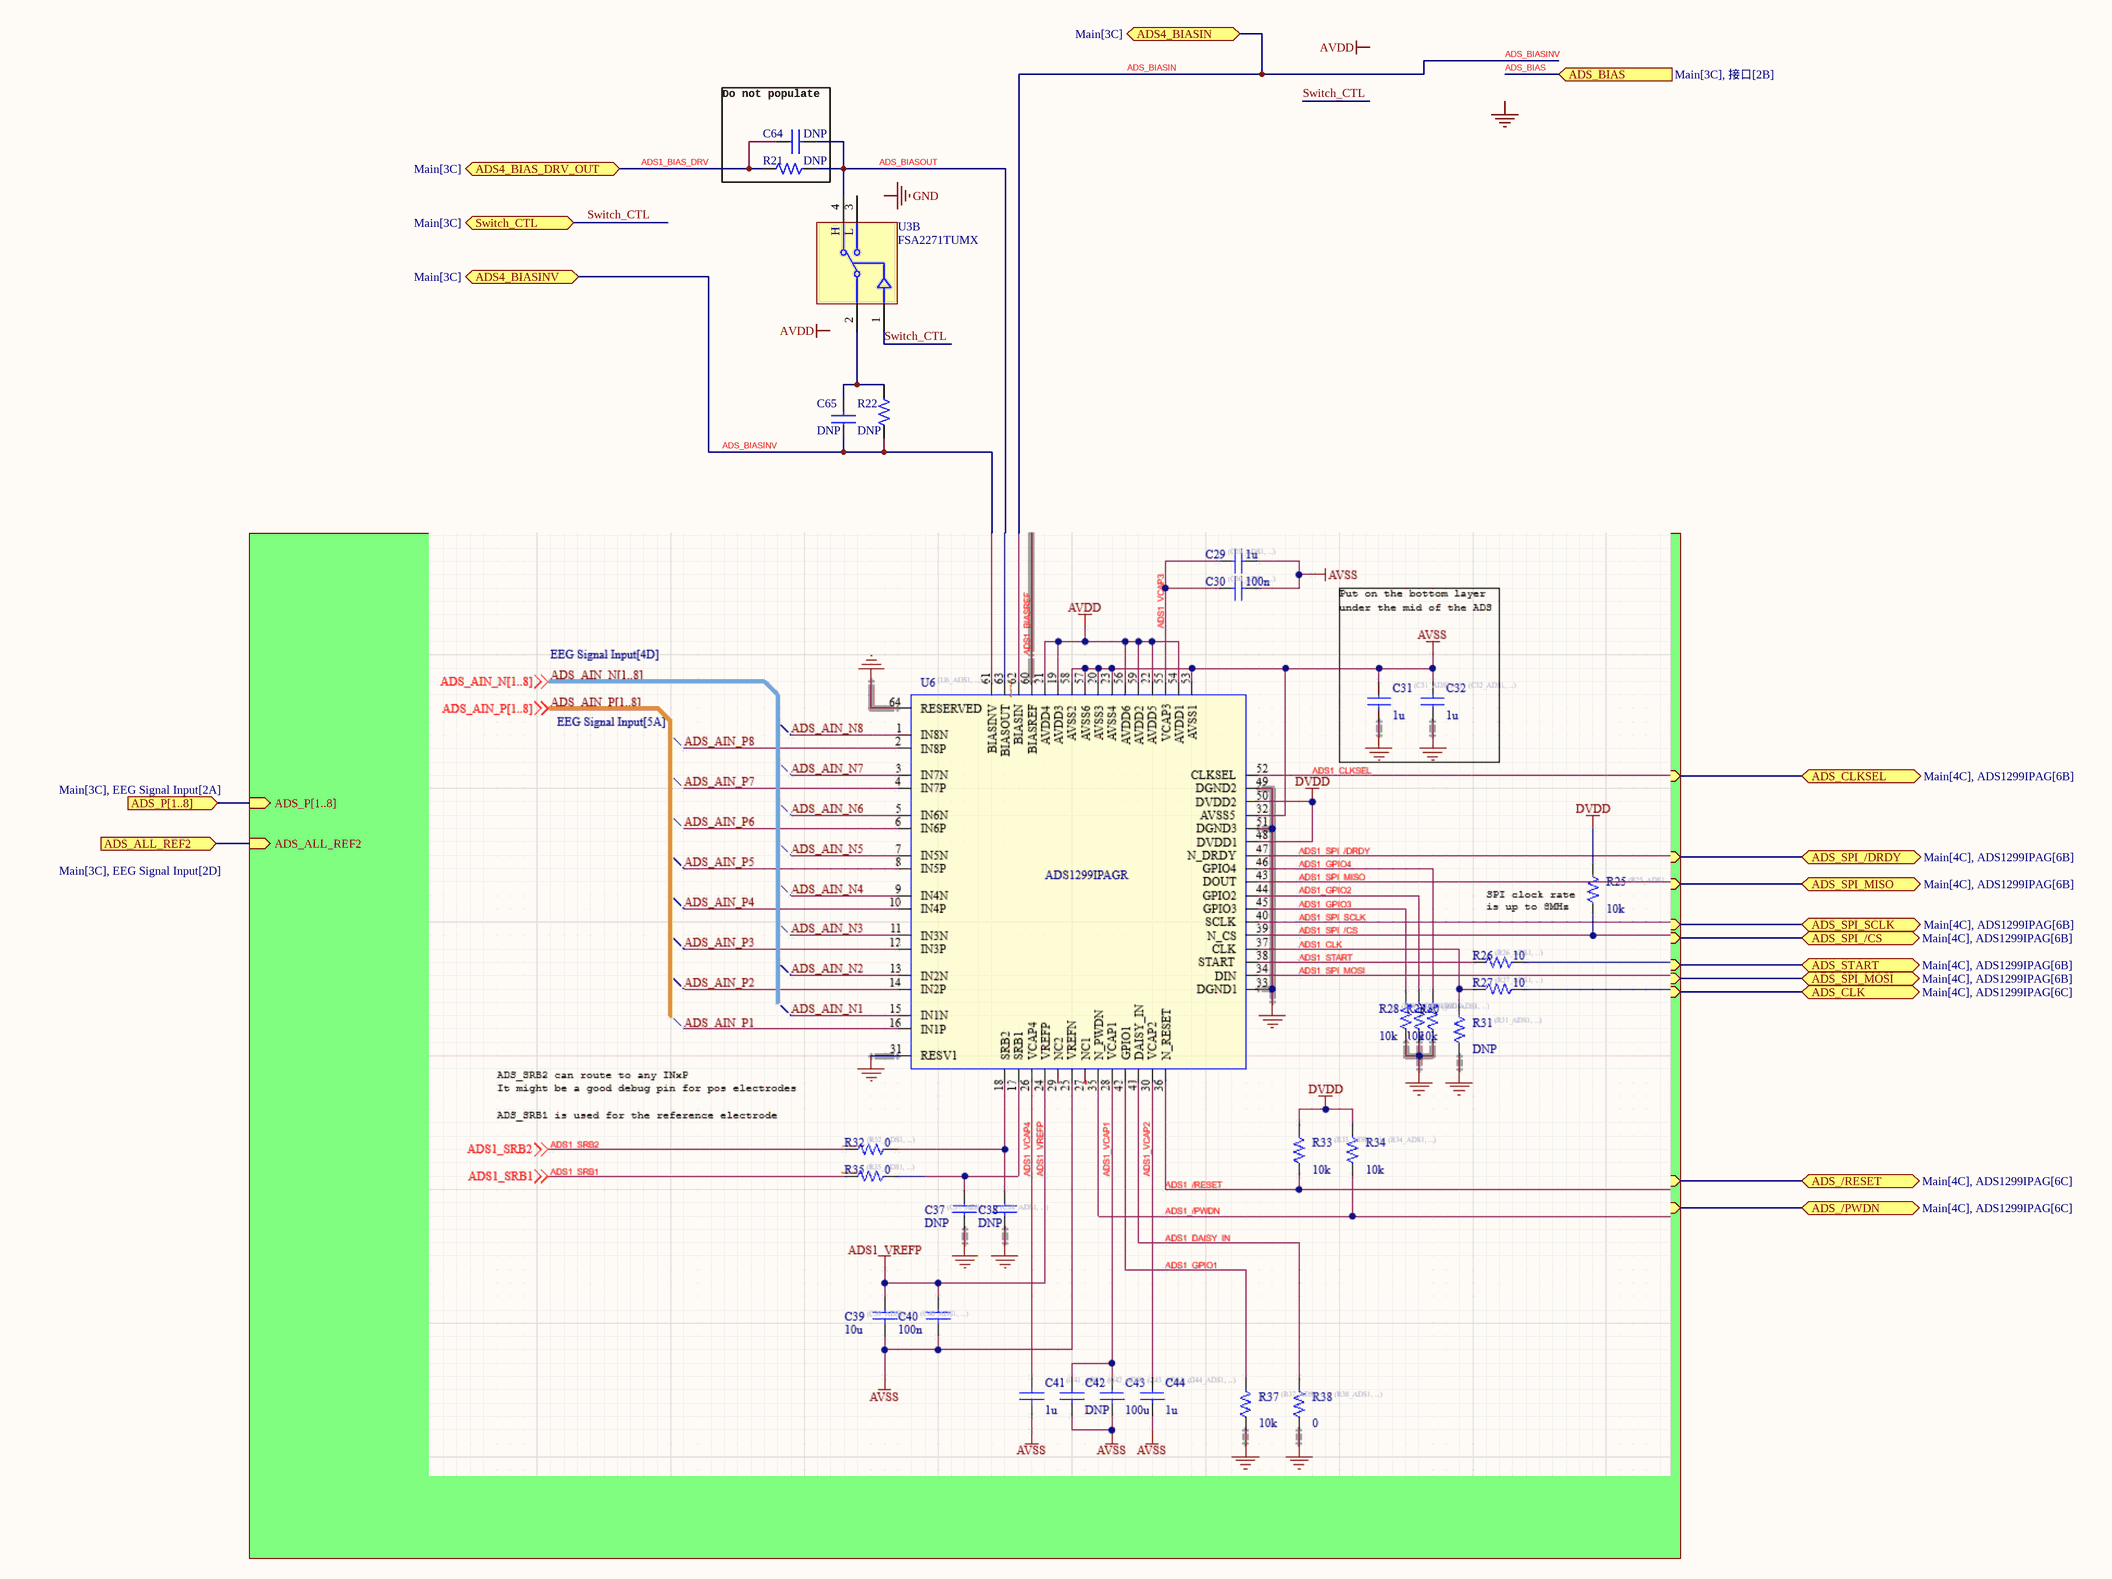
[diagram p6: ADS1299DRV.SchDoc]

### Parts
C64  DNP  [0402_C]
C65  DNP  [0402_C]
R21  DNP  [0402_R]
R22  DNP  [0402_R]
U3  FSA2271TUMX  [UFQFN-10(1.4x1.8)]  (part B of 2)

### Blocks framed on the sheet
Do not populate: C64 R21

### Sub-sheets
ADS4 = ADS1299IPAG.SchDoc;EEG Signal Input.SchDoc: ADS_P[1..8] (in), ADS_SPI_MOSI (bidir), ADS_SPI_/CS (bidir), ADS_SPI_SCLK (bidir), ADS_SPI_MISO (bidir), ADS_ALL_REF2 (in), ADS_BIASINV (bidir), ADS_START (bidir), ADS_CLK (bidir), ADS_SPI_/DRDY (bidir), ADS_/RESET (bidir), ADS_/PWDN (bidir), ADS_BIASIN (bidir), ADS_CLKSEL (bidir), ADS_BIASOUT (bidir)

### Ports
ADS4_BIAS_DRV_OUT (bidir, see Main[3C]), ADS4_BIASIN (bidir, see Main[3C]), ADS4_BIASINV (bidir, see Main[3C]), ADS_/PWDN (bidir, see Main[4C], ADS1299IPAG[6C]), ADS_/RESET (bidir, see Main[4C], ADS1299IPAG[6C]), ADS_ALL_REF2 (in, see Main[3C], EEG Signal Input[2D]), ADS_BIAS (in, see Main[3C], 接口[2B]), ADS_CLK (bidir, see Main[4C], ADS1299IPAG[6C]), ADS_CLKSEL (bidir, see Main[4C], ADS1299IPAG[6B]), ADS_P[1..8] (in, see Main[3C], EEG Signal Input[2A]), ADS_SPI_/CS (bidir, see Main[4C], ADS1299IPAG[6B]), ADS_SPI_/DRDY (bidir, see Main[4C], ADS1299IPAG[6B]), ADS_SPI_MISO (bidir, see Main[4C], ADS1299IPAG[6B]), ADS_SPI_MOSI (bidir, see Main[4C], ADS1299IPAG[6B]), ADS_SPI_SCLK (bidir, see Main[4C], ADS1299IPAG[6B]), ADS_START (bidir, see Main[4C], ADS1299IPAG[6B]), Switch_CTL (bidir, see Main[3C])

### Nets
ADS1_BIAS_DRV: C64.1 R21.2 ; port ADS4_BIAS_DRV_OUT
ADS1_CLKSEL: port ADS_CLKSEL, sheet ADS4/ADS_CLKSEL
ADS_BIASIN: C65.1 R22.2 ; port ADS4_BIASINV, port ADS4_BIASIN, sheet ADS4/ADS_BIASINV, sheet ADS4/ADS_BIASIN  [also labelled ADS_BIASINV]
ADS_BIASOUT: C64.2 R21.1 U3.4(2B1) ; sheet ADS4/ADS_BIASOUT
ADS_CLK: port ADS_CLK, sheet ADS4/ADS_CLK
ADS_DRDY4: port ADS_SPI_/DRDY, sheet ADS4/ADS_SPI_/DRDY
ADS_PWDN: port ADS_/PWDN, sheet ADS4/ADS_/PWDN
ADS_REF: port ADS_ALL_REF2, sheet ADS4/ADS_ALL_REF2
ADS_RESET: port ADS_/RESET, sheet ADS4/ADS_/RESET
ADS_SPI_CLK: port ADS_SPI_SCLK, sheet ADS4/ADS_SPI_SCLK
ADS_SPI_CS3: port ADS_SPI_/CS, sheet ADS4/ADS_SPI_/CS
ADS_SPI_MISO: port ADS_SPI_MISO, sheet ADS4/ADS_SPI_MISO
ADS_SPI_MOSI: port ADS_SPI_MOSI, sheet ADS4/ADS_SPI_MOSI
ADS_START: port ADS_START, sheet ADS4/ADS_START
Switch_CTL: U3.1(S2) ; port Switch_CTL
NetC65_2: C65.2 R22.1 U3.2(2A)

Not connected (* = marked no-connect by the designer): U3 3(2B0)

### Buses and harness runs
bus port ADS_P[1..8] = sheet ADS4/ADS_P[1..8]

### Notes on the sheet
- Labels drawn without touching a wire or pin: AVDD, GND
- (in symbol FSA2271TUMX, part B) H; L

### Library data of the parts
C64 C65 = CAP0402: FPLIST: 0402_smd; PCB Footprint: C0402
R21 R22 = RES: PCB Footprint: R0402

## Nets that join several sheets
3V3: Main (R1.1 R23.1 U1.1), ADS1 (7 pins), ADS2 (7 pins), ADS3 (7 pins), 外围 (5 pins), Power (6 pins), ADS5/ADS4 (7 pins)
ADS1_VREFP: ADS1 (C39_ADS1.1 C40_ADS1.1 U6_ADS1.24), ADS2 (C39_ADS2.1 C40_ADS2.1 U6_ADS2.24), ADS3 (C39_ADS3.1 C40_ADS3.1 U6_ADS3.24), ADS5/ADS4 (C39_ADS4.1 C40_ADS4.1 U6_ADS4.24)
AVDD: Main (U3.10), ADS1 (18 pins), ADS2 (18 pins), ADS3 (18 pins), Power (C109.1 C116.1 L4.2 TP10.1), ADS5/ADS4 (18 pins)
AVSS: ADS1 (27 pins), ADS2 (27 pins), ADS3 (27 pins), Power (C115.1 C116.2 L5.2 TP15.1), ADS5/ADS4 (27 pins)
GND: Main (7 pins), ADS1 (20 pins), ADS1 (25 pins), 接口 (J7.36), ADS2 (20 pins), ADS2 (25 pins), ADS3 (20 pins), ADS3 (25 pins), 外围 (C18.2 U5.2), Power (34 pins), ADS5/ADS4 (20 pins), ADS5/ADS4 (25 pins)
OUT_5V: Main (U1.2), 接口 (J7.1)
ADS1_1P: ADS1 (D11_ADS1.1 R54_ADS1.2), 接口 (J7.2)
ADS1_2P: ADS1 (D10_ADS1.1 R52_ADS1.2), 接口 (J7.19)
ADS1_3P: ADS1 (D9_ADS1.1 R50_ADS1.2), 接口 (J7.3)
ADS1_4P: ADS1 (D8_ADS1.1 R48_ADS1.2), 接口 (J7.20)
ADS1_5P: ADS1 (D7_ADS1.1 R46_ADS1.2), 接口 (J7.4)
ADS1_6P: ADS1 (D6_ADS1.1 R44_ADS1.2), 接口 (J7.21)
ADS1_7P: ADS1 (D5_ADS1.1 R42_ADS1.2), 接口 (J7.5)
ADS1_8P: ADS1 (D4_ADS1.1 R40_ADS1.2), 接口 (J7.22)
ADS1_BIAS_DRV: Main (U3.9), ADS1299DRV (C64.1 R21.2)
ADS1_CLKSEL: Main (R1.2 R2.2), ADS5/ADS4 (U6_ADS4.52)
ADS2_1P: 接口 (J7.6), ADS2 (D11_ADS2.1 R54_ADS2.2)
ADS2_2P: 接口 (J7.23), ADS2 (D10_ADS2.1 R52_ADS2.2)
ADS2_3P: 接口 (J7.7), ADS2 (D9_ADS2.1 R50_ADS2.2)
ADS2_4P: 接口 (J7.24), ADS2 (D8_ADS2.1 R48_ADS2.2)
ADS2_5P: 接口 (J7.8), ADS2 (D7_ADS2.1 R46_ADS2.2)
ADS2_6P: 接口 (J7.25), ADS2 (D6_ADS2.1 R44_ADS2.2)
ADS2_7P: 接口 (J7.9), ADS2 (D5_ADS2.1 R42_ADS2.2)
ADS2_8P: 接口 (J7.26), ADS2 (D4_ADS2.1 R40_ADS2.2)
ADS3_1P: 接口 (J7.11), ADS3 (D11_ADS3.1 R54_ADS3.2)
ADS3_2P: 接口 (J7.28), ADS3 (D10_ADS3.1 R52_ADS3.2)
ADS3_3P: 接口 (J7.12), ADS3 (D9_ADS3.1 R50_ADS3.2)
ADS3_4P: 接口 (J7.29), ADS3 (D8_ADS3.1 R48_ADS3.2)
ADS3_5P: 接口 (J7.13), ADS3 (D7_ADS3.1 R46_ADS3.2)
ADS3_6P: 接口 (J7.30), ADS3 (D6_ADS3.1 R44_ADS3.2)
ADS3_7P: 接口 (J7.14), ADS3 (D5_ADS3.1 R42_ADS3.2)
ADS3_8P: 接口 (J7.31), ADS3 (D4_ADS3.1 R40_ADS3.2)
ADS4_1P: 接口 (J7.15), ADS5/ADS4 (D11_ADS4.1 R54_ADS4.2)
ADS4_2P: 接口 (J7.32), ADS5/ADS4 (D10_ADS4.1 R52_ADS4.2)
ADS4_3P: 接口 (J7.16), ADS5/ADS4 (D9_ADS4.1 R50_ADS4.2)
ADS4_4P: 接口 (J7.33), ADS5/ADS4 (D8_ADS4.1 R48_ADS4.2)
ADS4_5P: 接口 (J7.17), ADS5/ADS4 (D7_ADS4.1 R46_ADS4.2)
ADS4_6P: 接口 (J7.34), ADS5/ADS4 (D6_ADS4.1 R44_ADS4.2)
ADS4_7P: 接口 (J7.18), ADS5/ADS4 (D5_ADS4.1 R42_ADS4.2)
ADS4_8P: 接口 (J7.35), ADS5/ADS4 (D4_ADS4.1 R40_ADS4.2)
ADS_AIN_N1: ADS1 (U6_ADS1.15), ADS1 (C61_ADS1.1 R56_ADS1.1)
ADS_AIN_N1: ADS2 (U6_ADS2.15), ADS2 (C61_ADS2.1 R56_ADS2.1)
ADS_AIN_N1: ADS3 (U6_ADS3.15), ADS3 (C61_ADS3.1 R56_ADS3.1)
ADS_AIN_N1: ADS5/ADS4 (U6_ADS4.15), ADS5/ADS4 (C61_ADS4.1 R56_ADS4.1)
ADS_AIN_N2: ADS1 (U6_ADS1.13), ADS1 (C59_ADS1.1 R53_ADS1.1)
ADS_AIN_N2: ADS2 (U6_ADS2.13), ADS2 (C59_ADS2.1 R53_ADS2.1)
ADS_AIN_N2: ADS3 (U6_ADS3.13), ADS3 (C59_ADS3.1 R53_ADS3.1)
ADS_AIN_N2: ADS5/ADS4 (U6_ADS4.13), ADS5/ADS4 (C59_ADS4.1 R53_ADS4.1)
ADS_AIN_N3: ADS1 (U6_ADS1.11), ADS1 (C57_ADS1.1 R51_ADS1.1)
ADS_AIN_N3: ADS2 (U6_ADS2.11), ADS2 (C57_ADS2.1 R51_ADS2.1)
ADS_AIN_N3: ADS3 (U6_ADS3.11), ADS3 (C57_ADS3.1 R51_ADS3.1)
ADS_AIN_N3: ADS5/ADS4 (U6_ADS4.11), ADS5/ADS4 (C57_ADS4.1 R51_ADS4.1)
ADS_AIN_N4: ADS1 (U6_ADS1.9), ADS1 (C55_ADS1.1 R49_ADS1.1)
ADS_AIN_N4: ADS2 (U6_ADS2.9), ADS2 (C55_ADS2.1 R49_ADS2.1)
ADS_AIN_N4: ADS3 (U6_ADS3.9), ADS3 (C55_ADS3.1 R49_ADS3.1)
ADS_AIN_N4: ADS5/ADS4 (U6_ADS4.9), ADS5/ADS4 (C55_ADS4.1 R49_ADS4.1)
ADS_AIN_N5: ADS1 (U6_ADS1.7), ADS1 (C53_ADS1.1 R47_ADS1.1)
ADS_AIN_N5: ADS2 (U6_ADS2.7), ADS2 (C53_ADS2.1 R47_ADS2.1)
ADS_AIN_N5: ADS3 (U6_ADS3.7), ADS3 (C53_ADS3.1 R47_ADS3.1)
ADS_AIN_N5: ADS5/ADS4 (U6_ADS4.7), ADS5/ADS4 (C53_ADS4.1 R47_ADS4.1)
ADS_AIN_N6: ADS1 (U6_ADS1.5), ADS1 (C51_ADS1.1 R45_ADS1.1)
ADS_AIN_N6: ADS2 (U6_ADS2.5), ADS2 (C51_ADS2.1 R45_ADS2.1)
ADS_AIN_N6: ADS3 (U6_ADS3.5), ADS3 (C51_ADS3.1 R45_ADS3.1)
ADS_AIN_N6: ADS5/ADS4 (U6_ADS4.5), ADS5/ADS4 (C51_ADS4.1 R45_ADS4.1)
ADS_AIN_N7: ADS1 (U6_ADS1.3), ADS1 (C49_ADS1.1 R43_ADS1.1)
ADS_AIN_N7: ADS2 (U6_ADS2.3), ADS2 (C49_ADS2.1 R43_ADS2.1)
ADS_AIN_N7: ADS3 (U6_ADS3.3), ADS3 (C49_ADS3.1 R43_ADS3.1)
ADS_AIN_N7: ADS5/ADS4 (U6_ADS4.3), ADS5/ADS4 (C49_ADS4.1 R43_ADS4.1)
ADS_AIN_N8: ADS1 (U6_ADS1.1), ADS1 (C47_ADS1.1 R41_ADS1.1)
ADS_AIN_N8: ADS2 (U6_ADS2.1), ADS2 (C47_ADS2.1 R41_ADS2.1)
ADS_AIN_N8: ADS3 (U6_ADS3.1), ADS3 (C47_ADS3.1 R41_ADS3.1)
ADS_AIN_N8: ADS5/ADS4 (U6_ADS4.1), ADS5/ADS4 (C47_ADS4.1 R41_ADS4.1)
ADS_AIN_P1: ADS1 (U6_ADS1.16), ADS1 (C60_ADS1.2 R54_ADS1.1)
ADS_AIN_P1: ADS2 (U6_ADS2.16), ADS2 (C60_ADS2.2 R54_ADS2.1)
ADS_AIN_P1: ADS3 (U6_ADS3.16), ADS3 (C60_ADS3.2 R54_ADS3.1)
ADS_AIN_P1: ADS5/ADS4 (U6_ADS4.16), ADS5/ADS4 (C60_ADS4.2 R54_ADS4.1)
ADS_AIN_P2: ADS1 (U6_ADS1.14), ADS1 (C58_ADS1.2 R52_ADS1.1)
ADS_AIN_P2: ADS2 (U6_ADS2.14), ADS2 (C58_ADS2.2 R52_ADS2.1)
ADS_AIN_P2: ADS3 (U6_ADS3.14), ADS3 (C58_ADS3.2 R52_ADS3.1)
ADS_AIN_P2: ADS5/ADS4 (U6_ADS4.14), ADS5/ADS4 (C58_ADS4.2 R52_ADS4.1)
ADS_AIN_P3: ADS1 (U6_ADS1.12), ADS1 (C56_ADS1.2 R50_ADS1.1)
ADS_AIN_P3: ADS2 (U6_ADS2.12), ADS2 (C56_ADS2.2 R50_ADS2.1)
ADS_AIN_P3: ADS3 (U6_ADS3.12), ADS3 (C56_ADS3.2 R50_ADS3.1)
ADS_AIN_P3: ADS5/ADS4 (U6_ADS4.12), ADS5/ADS4 (C56_ADS4.2 R50_ADS4.1)
ADS_AIN_P4: ADS1 (U6_ADS1.10), ADS1 (C54_ADS1.2 R48_ADS1.1)
ADS_AIN_P4: ADS2 (U6_ADS2.10), ADS2 (C54_ADS2.2 R48_ADS2.1)
ADS_AIN_P4: ADS3 (U6_ADS3.10), ADS3 (C54_ADS3.2 R48_ADS3.1)
ADS_AIN_P4: ADS5/ADS4 (U6_ADS4.10), ADS5/ADS4 (C54_ADS4.2 R48_ADS4.1)
ADS_AIN_P5: ADS1 (U6_ADS1.8), ADS1 (C52_ADS1.2 R46_ADS1.1)
ADS_AIN_P5: ADS2 (U6_ADS2.8), ADS2 (C52_ADS2.2 R46_ADS2.1)
ADS_AIN_P5: ADS3 (U6_ADS3.8), ADS3 (C52_ADS3.2 R46_ADS3.1)
ADS_AIN_P5: ADS5/ADS4 (U6_ADS4.8), ADS5/ADS4 (C52_ADS4.2 R46_ADS4.1)
ADS_AIN_P6: ADS1 (U6_ADS1.6), ADS1 (C50_ADS1.2 R44_ADS1.1)
ADS_AIN_P6: ADS2 (U6_ADS2.6), ADS2 (C50_ADS2.2 R44_ADS2.1)
ADS_AIN_P6: ADS3 (U6_ADS3.6), ADS3 (C50_ADS3.2 R44_ADS3.1)
ADS_AIN_P6: ADS5/ADS4 (U6_ADS4.6), ADS5/ADS4 (C50_ADS4.2 R44_ADS4.1)
ADS_AIN_P7: ADS1 (U6_ADS1.4), ADS1 (C48_ADS1.2 R42_ADS1.1)
ADS_AIN_P7: ADS2 (U6_ADS2.4), ADS2 (C48_ADS2.2 R42_ADS2.1)
ADS_AIN_P7: ADS3 (U6_ADS3.4), ADS3 (C48_ADS3.2 R42_ADS3.1)
ADS_AIN_P7: ADS5/ADS4 (U6_ADS4.4), ADS5/ADS4 (C48_ADS4.2 R42_ADS4.1)
ADS_AIN_P8: ADS1 (U6_ADS1.2), ADS1 (C46_ADS1.2 R40_ADS1.1)
ADS_AIN_P8: ADS2 (U6_ADS2.2), ADS2 (C46_ADS2.2 R40_ADS2.1)
ADS_AIN_P8: ADS3 (U6_ADS3.2), ADS3 (C46_ADS3.2 R40_ADS3.1)
ADS_AIN_P8: ADS5/ADS4 (U6_ADS4.2), ADS5/ADS4 (C46_ADS4.2 R40_ADS4.1)
ADS_BIAS: Main (C45.2 D13.2 R39.2), 接口 (J7.10)
ADS_BIASIN: Main (U3.8), ADS1 (U6_ADS1.61 U6_ADS1.62), ADS2 (U6_ADS2.61 U6_ADS2.62), ADS3 (U6_ADS3.61 U6_ADS3.62), ADS1299DRV (C65.1 R22.2), ADS5/ADS4 (U6_ADS4.61 U6_ADS4.62)
ADS_BIASOUT: ADS1299DRV (C64.2 R21.1 U3.4), ADS5/ADS4 (U6_ADS4.63)
ADS_CLK: ADS1 (R27_ADS1.1), ADS2 (R27_ADS2.1), ADS3 (R27_ADS3.1), ADS5/ADS4 (R27_ADS4.1)
ADS_CLKSEL: Main (R23.2 R24.2), ADS1 (U6_ADS1.52), ADS2 (U6_ADS2.52), ADS3 (U6_ADS3.52)
ADS_DRDY1: Main (U1.5), ADS1 (U6_ADS1.47)
ADS_DRDY2: Main (U1.4), ADS2 (U6_ADS2.47)
ADS_DRDY3: Main (U1.3), ADS3 (U6_ADS3.47)
ADS_DRDY4: Main (U1.10), ADS5/ADS4 (U6_ADS4.47)
ADS_PWDN: Main (U1.16), ADS1 (R34_ADS1.2 U6_ADS1.35), ADS2 (R34_ADS2.2 U6_ADS2.35), ADS3 (R34_ADS3.2 U6_ADS3.35), ADS5/ADS4 (R34_ADS4.2 U6_ADS4.35)
ADS_REF: ADS1 (9 pins), 接口 (J7.27), ADS2 (9 pins), ADS3 (9 pins), ADS5/ADS4 (9 pins)
ADS_RESET: Main (U1.15), ADS1 (R33_ADS1.2 U6_ADS1.36), ADS2 (R33_ADS2.2 U6_ADS2.36), ADS3 (R33_ADS3.2 U6_ADS3.36), ADS5/ADS4 (R33_ADS4.2 U6_ADS4.36)
ADS_SPI_CLK: Main (U1.13), ADS1 (U6_ADS1.40), ADS2 (U6_ADS2.40), ADS3 (U6_ADS3.40), ADS5/ADS4 (U6_ADS4.40)
ADS_SPI_CS0: Main (U1.6), ADS1 (R25_ADS1.2 U6_ADS1.39)
ADS_SPI_CS1: Main (U1.7), ADS2 (R25_ADS2.2 U6_ADS2.39)
ADS_SPI_CS2: Main (U1.8), ADS3 (R25_ADS3.2 U6_ADS3.39)
ADS_SPI_CS3: Main (U1.9), ADS5/ADS4 (R25_ADS4.2 U6_ADS4.39)
ADS_SPI_MISO: Main (U1.12), ADS1 (U6_ADS1.43), ADS2 (U6_ADS2.43), ADS3 (U6_ADS3.43), ADS5/ADS4 (U6_ADS4.43)
ADS_SPI_MOSI: Main (U1.11), ADS1 (U6_ADS1.34), ADS2 (U6_ADS2.34), ADS3 (U6_ADS3.34), ADS5/ADS4 (U6_ADS4.34)
ADS_START: Main (U1.14), ADS1 (R26_ADS1.1), ADS2 (R26_ADS2.1), ADS3 (R26_ADS3.1), ADS5/ADS4 (R26_ADS4.1)
I2C_SCL: Main (U1.22), 外围 (R15.2 U5.3)
I2C_SDA: Main (U1.21), 外围 (R17.2 U5.5)
IO17: Main (U1.17), 外围 (R16.2 U5.4)
PD_CTL: Main (U1.18), Power (9 pins)
Switch_CTL: Main (U3.6), ADS1299DRV (U3.1)